# EasyEDA Pro project ALLModule_v1_0_2025-04-21.eprj, board MasterCtrlPCB
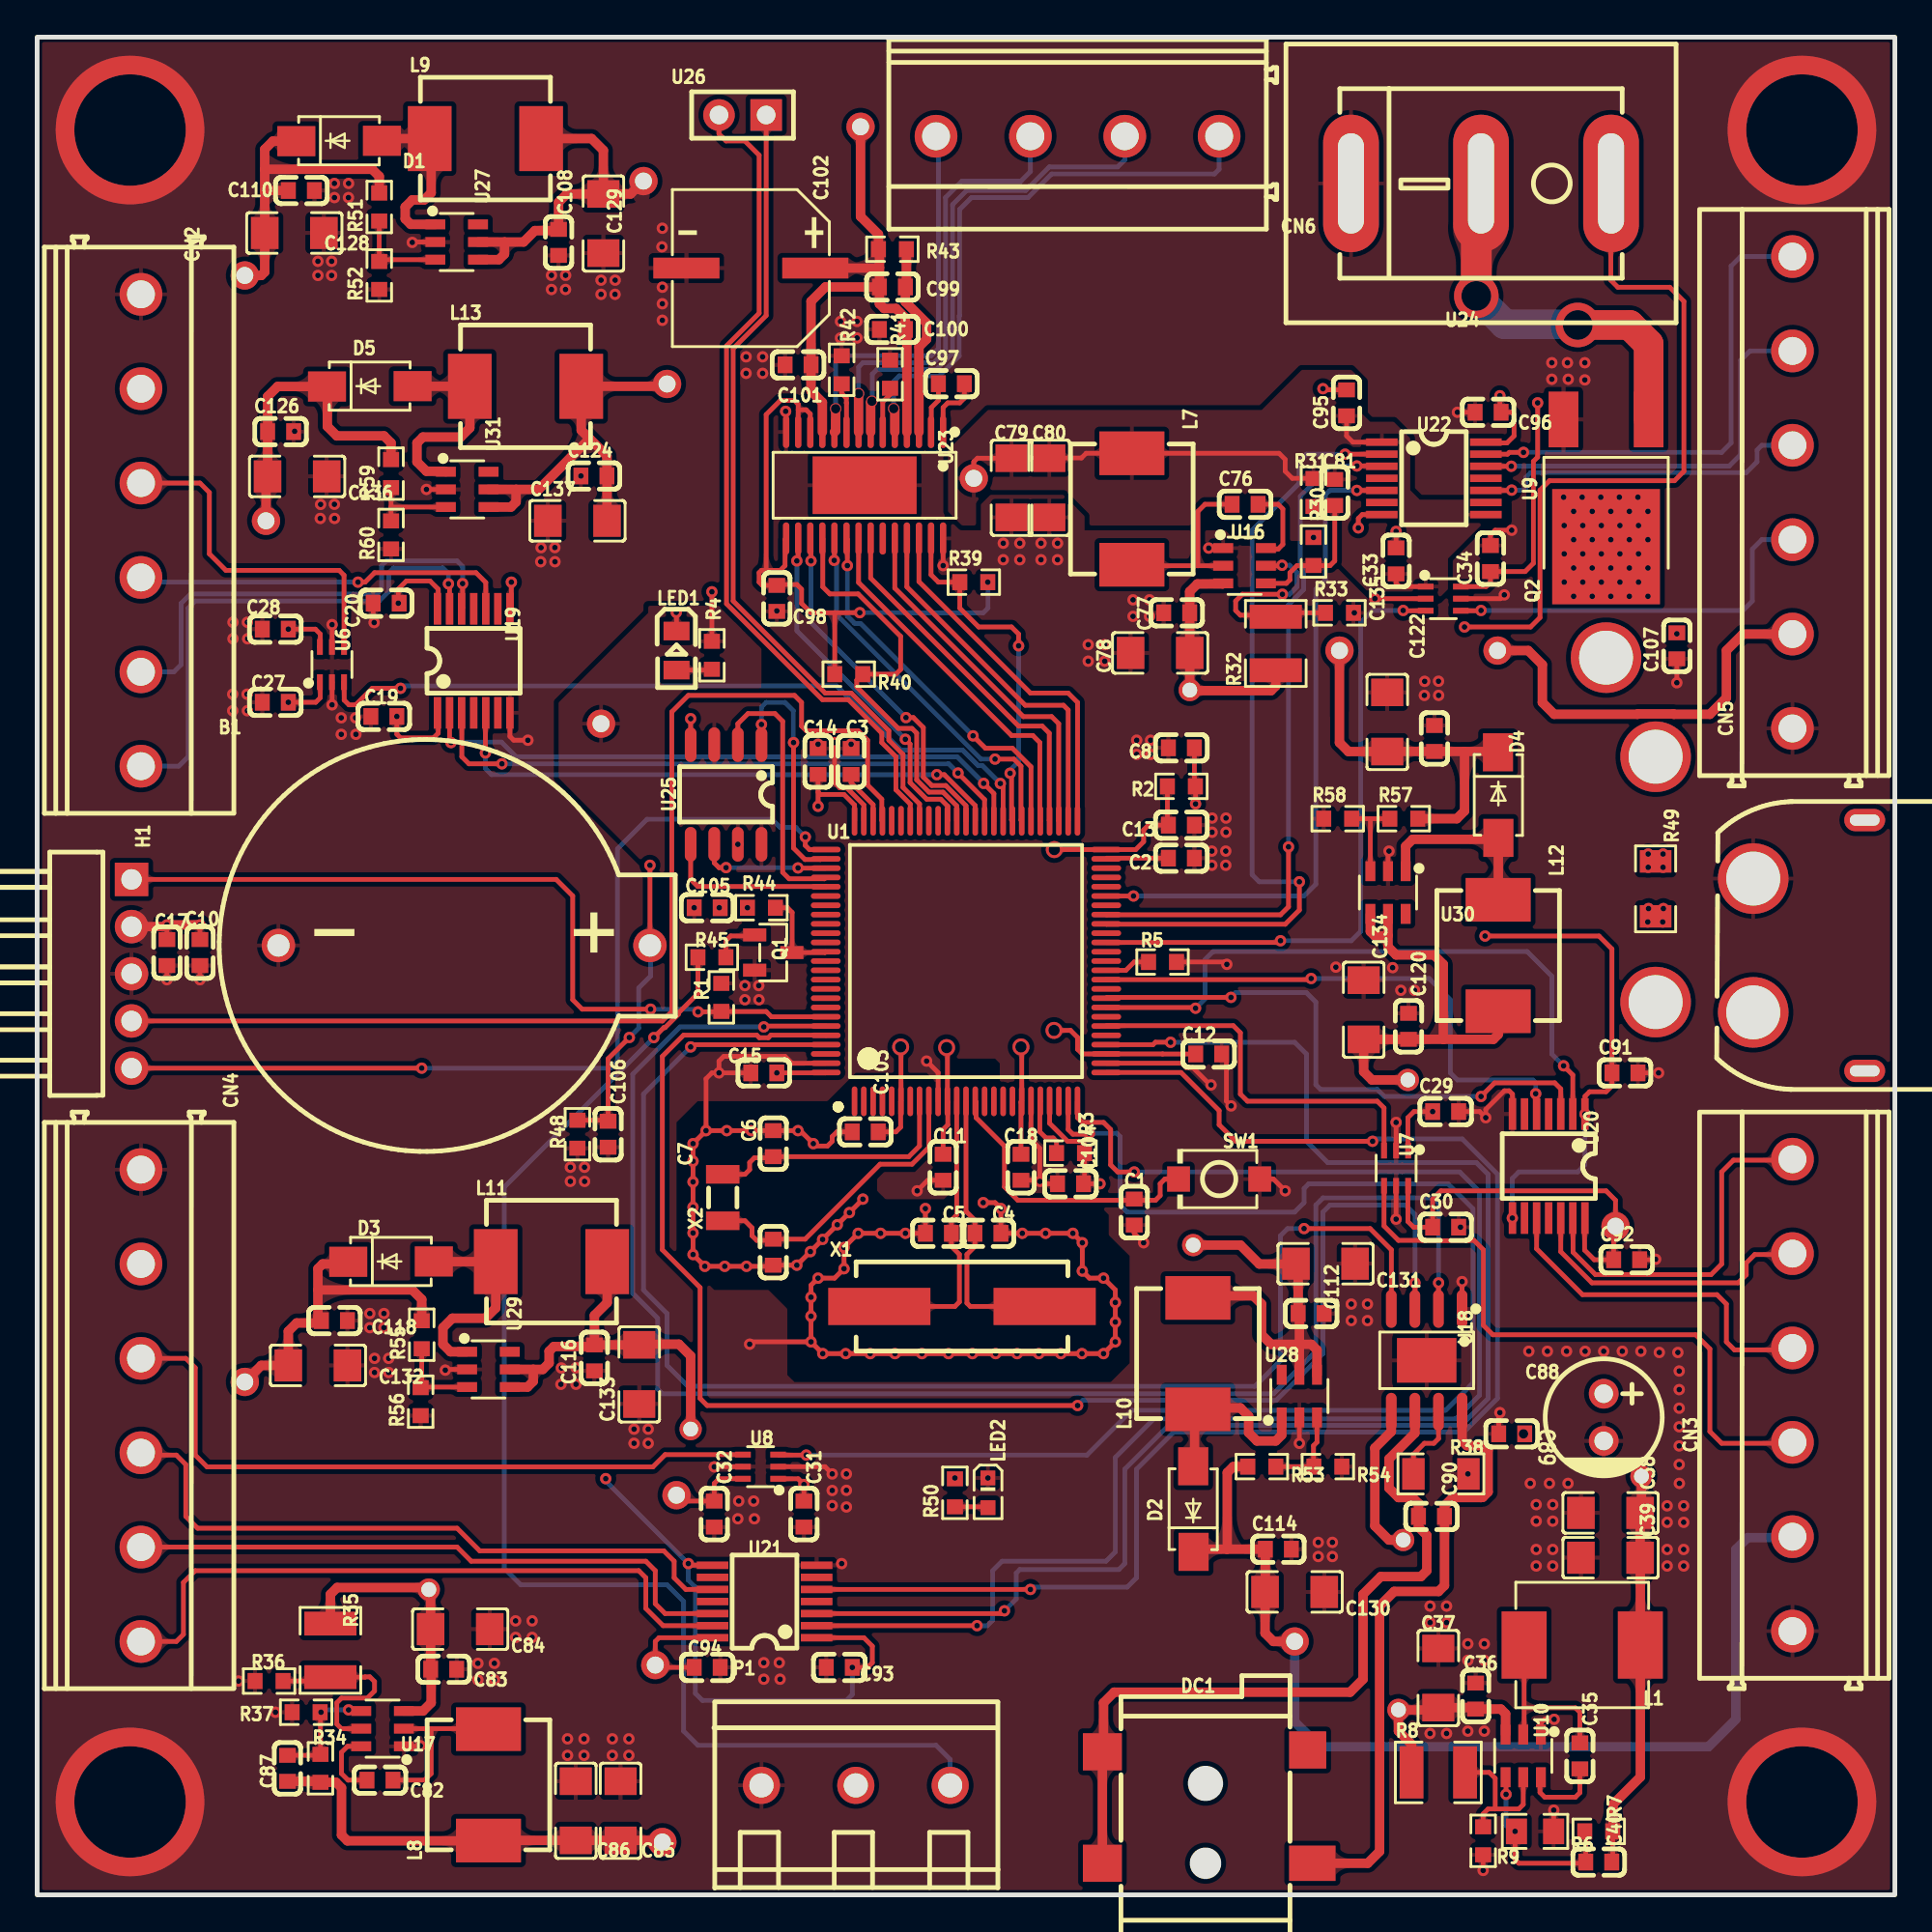
[diagram p4: board, top side]
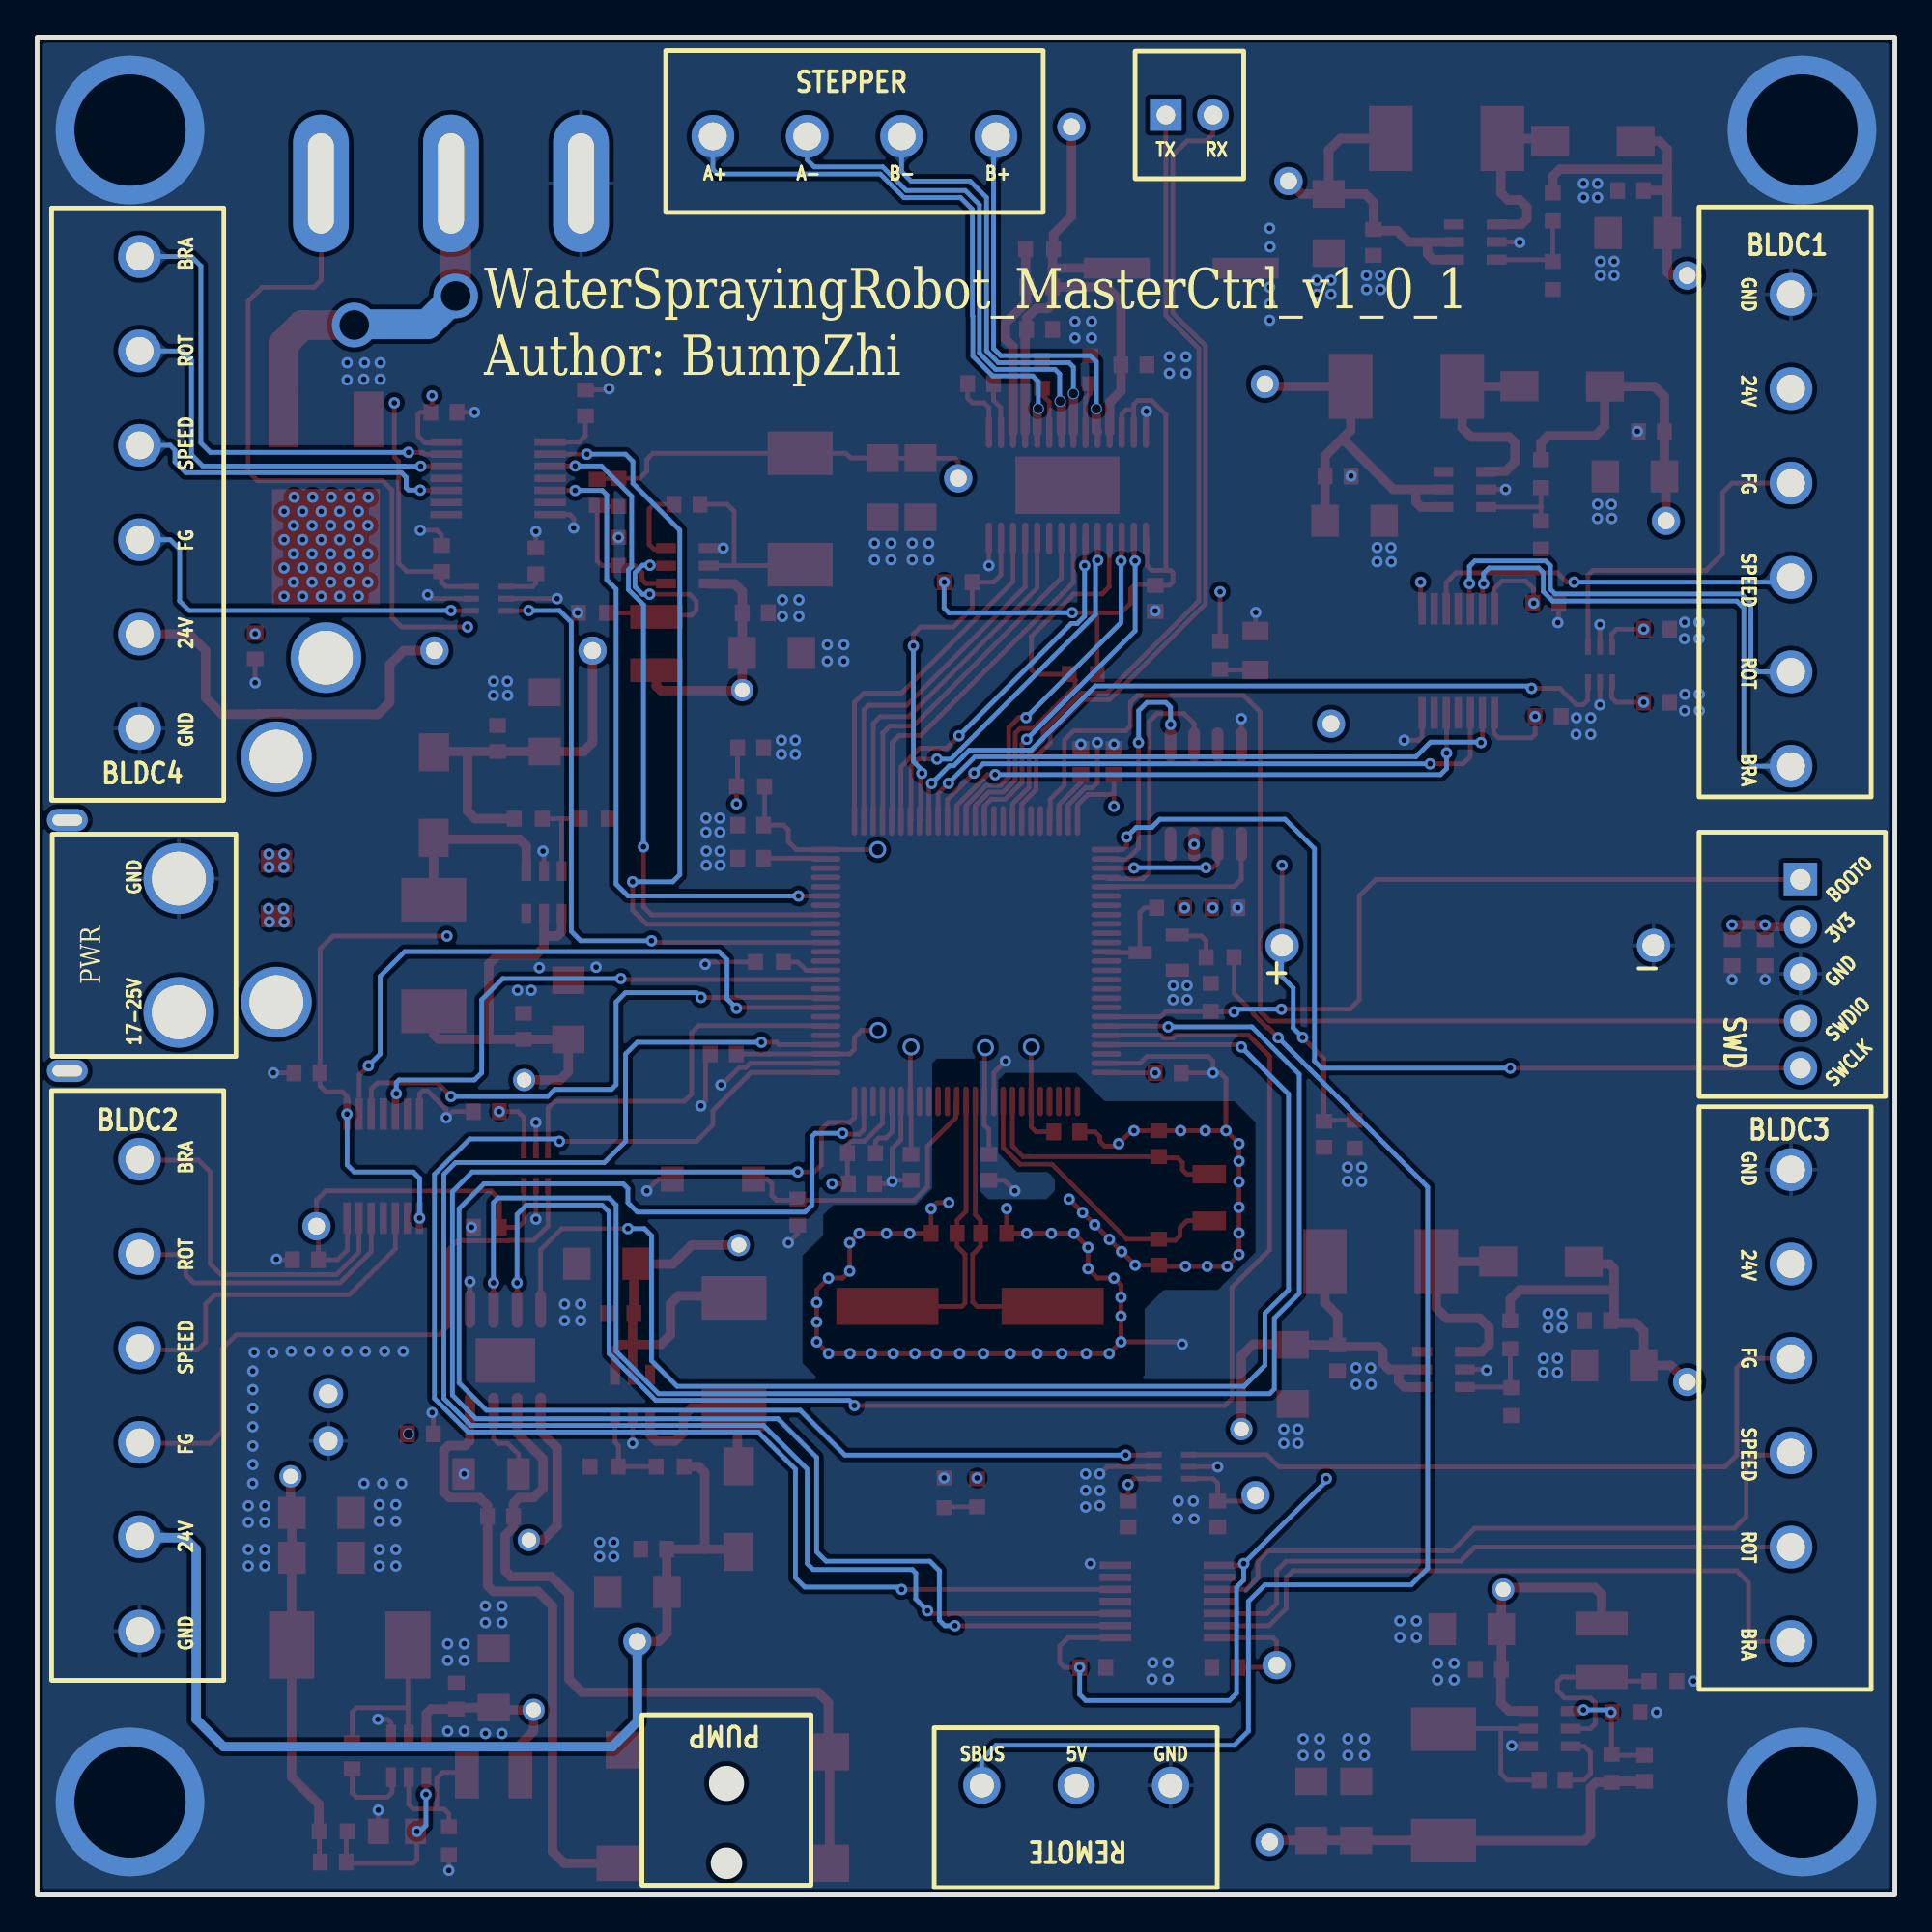
[diagram p5: board, bottom side, seen from below]

Outline 100 x 100 mm; copper layers: Top Layer, GND, PWR, Bottom Layer. Coordinates in mm from the lower left corner of the outline.
Outline path: rectangle 0,100 100,0
Stack: Top Layer 0.035mm 外层铜厚1oz / Dielectric1 0.2104mm 7628 RC49% 8.6mil / GND 0.0152mm 内层铜厚 / Dielectric2 1.065mm 1.1mm H/HOZ Copper / PWR 0.0152mm 内层铜厚 / Dielectric3 0.2104mm 7628 RC49% 8.6mil / Bottom Layer 0.035mm 外层铜厚1oz

## Design rules (mm)
net $1N1870: DP1
net $1N1876: DP1
net $1N2151: DP2
net $1N2157: DP2
template: JLCPCB Capability(Two Layers Board)
spacing copperThickness1oz (default): track to track 0.102, other pairs 0.152 to 0.3
spacing copperThickness2oz: track to track 0.203, other pairs 0.152 to 0.3
track width copperThickness1oz (default): min 0.127, default 0.254, max 2.54
track width copperThickness2oz: min 0.203, default 0.254, max 2.54
differential pair differentialPair (default): width min 0.127, default 0.254, max 2.54; gap min 0.152, default 0.152
via viaSize (default): diameter min 0.5, default 0.61, max 10; hole min 0.3, default 0.305, max 6.3

## Placement (name value [footprint] x y rotation side)
B1  BS-02-A1AJ010  [BAT-TH_BS-02-A1AJ010]  22.99 51.11 0 top
C1  100nF  [C0603]  59.06 36.75 90 top
C2  2.2uF  [C0603]  61.59 55.8 180 top
C3  2.2uF  [C0603]  43.81 61.01 270 top
C4  20pF  [C0603]  51.18 35.61 180 top
C5  20pF  [C0603]  48.51 35.61 0 top
C6  20pF  [C0603]  39.62 40.44 270 top
C7  20pF  [C0603]  39.62 34.59 90 top
C8  100nF  [C0603]  61.59 61.74 180 top
C10  100nF  [C0603]  8.76 50.72 90 top
C11  100nF  [C0603]  48.77 39.17 90 top
C12  100nF  [C0603]  63.06 45.26 180 top
C13  100nF  [C0603]  61.59 57.58 180 top
C14  100nF  [C0603]  42.04 61.01 270 top
C15  100nF  [C0603]  39.12 44.25 0 top
C17  10uF  [C0603]  6.98 50.72 90 top
C18  100nF  [C0603]  52.96 39.17 90 top
C19  100nF  [C0603]  18.66 63.43 180 top
C20  100nF  [C0603]  18.79 69.53 180 top
C27  100nF  [C0603]  12.82 64.2 180 top
C28  100nF  [C0603]  12.82 68.13 180 top
C29  100nF  [C0603]  75.82 42.16 0 top
C30  100nF  [C0603]  75.82 35.94 0 top
C31  100nF  [C0603]  41.28 20.5 270 top
C32  100nF  [C0603]  36.45 20.5 270 top
C33  100nF  [C0603]  73.15 71.81 90 top
C34  100nF  [C0603]  78.23 71.93 90 top
C35  100nF  [C0603]  83.04 7.48 270 top
C36  100nF  [C0603]  77.43 10.7 270 top
C37  22uF  [C1206]  75.42 11.67 270 top
C38  22uF  [C1206]  84.7 20.56 0 top
C39  22uF  [C1206]  84.7 18.15 0 top
C40  100pF  [C0603]  84.06 1.76 0 top
C76  100nF  [C0603]  65.02 74.85 0 top
C77  100nF  [C0603]  61.34 69.01 0 top
C78  22uF  [C1206]  60.45 66.85 0 top
C79  22uF  [C1206]  52.45 75.74 90 top
C80  22uF  [C1206]  54.48 75.74 90 top
C81  47pF  [C0603]  69.85 75.49 90 top
C82  100nF  [C0603]  18.45 6.18 180 top
C83  100nF  [C0603]  21.88 12.14 180 top
C84  22uF  [C1206]  22.77 14.3 180 top
C85  22uF  [C1206]  31.41 4.52 270 top
C86  22uF  [C1206]  28.99 4.52 270 top
C87  100pF  [C0603]  13.47 6.81 270 top
C88  47uF  [CAP-TH_BD6.3-P2.50-D1.0-FD]  84.33 25.71 270 top
C89  100nF  [C0603]  79.38 24.82 0 top
C90  100nF  [C0603]  75.06 20.37 0 top
C91  100nF  [C0603]  85.47 44.25 0 top
C92  100nF  [C0603]  85.56 34.19 0 top
C93  100nF  [C0603]  43.18 12.24 180 top
C94  100nF  [C0603]  36.07 12.24 0 top
C95  100nF  [C0603]  70.49 80.31 90 top
C96  100nF  [C0603]  78.1 79.81 180 top
C97  10nF  [C0603]  49.21 81.35 0 top
C98  470nF  [C0603]  39.82 69.79 90 top
C99  100nF  [C0603]  46.04 86.55 0 top
C100  100nF  [C0603]  46.04 84.27 0 top
C101  100nF  [C0603]  40.96 82.36 0 top
C102  100uF  [CAP-SMD_BD8.1-L8.3-W8.3-LS9.3-FD]  38.42 87.57 180 top
C103  100nF  [C0603]  44.58 41.07 0 top
C104  10nF  [C0603]  55.63 38.28 0 top
C105  100nF  [C0603]  36.07 53.14 0 top
C106  100nF  [C0603]  30.73 40.94 270 top
C107  100nF  [C0603]  88.26 67.23 90 top
C108  100nF  [C0603]  28.07 88.95 90 top
C110  100nF  [C0603]  14.22 91.75 0 top
C112  100nF  [C0603]  68.58 31.29 180 top
C114  100nF  [C0603]  66.81 18.61 0 top
C116  100nF  [C0603]  30 28.9 90 top
C118  100nF  [C0603]  16 30.91 0 top
C120  100nF  [C0603]  73.82 46.75 270 top
C122  100nF  [C0603]  75.22 62.25 90 top
C124  100nF  [C0603]  29.97 76.38 0 top
C126  100nF  [C0603]  13.11 78.77 0 top
C128  10uF  [C1206]  13.84 89.46 180 top
C129  10uF  [C1206]  30.48 89.97 90 top
C130  10uF  [C1206]  67.69 16.31 180 top
C131  10uF  [C1206]  69.35 33.97 180 top
C132  10uF  [C1206]  15.11 28.5 180 top
C133  10uF  [C1206]  32.41 28.02 90 top
C134  10uF  [C1206]  71.41 47.64 270 top
C135  10uF  [C1206]  72.68 63.14 270 top
C136  10uF  [C1206]  13.99 76.35 180 top
C137  10uF  [C1206]  29.08 73.97 0 top
CN1  XT60PW-M  [CONN-TH_XT60PW-M]  95.38 51.11 180 top
CN2  DB128V-5.08-6P-GN-S  [CONN-TH_6P-P5.08_DIBO_DB128V-5.08]  5.59 73.46 270 top
CN3  DB128V-5.08-6P-GN-S  [CONN-TH_6P-P5.08_DIBO_DB128V-5.08]  94.49 26.9 90 top
CN4  DB128V-5.08-6P-GN-S  [CONN-TH_6P-P5.08_DIBO_DB128V-5.08]  5.59 26.34 270 top
CN5  DB128V-5.08-6P-GN-S  [CONN-TH_6P-P5.08_DIBO_DB128V-5.08]  94.49 75.49 90 top
CN6  DB128V-5.08-4P-GN-S  [CONN-TH_4P-P5.08_DIBO_DB128V-5.08]  56.01 94.67 180 top
D1  SS54  [SMA_L4.3-W2.6-LS5.0-FD]  16.26 94.41 180 top
D2  SS54  [SMA_L4.3-W2.6-LS5.0-FD]  62.24 20.77 270 top
D3  SS54  [SMA_L4.3-W2.6-LS5.0-FD]  19.05 34.09 180 top
D4  SS54  [SMA_L4.3-W2.6-LS5.0-FD]  78.65 59.2 90 top
D5  SS54  [SMA_L4.3-W2.6-LS5.0-FD]  17.91 81.2 180 top
DC1  DC050-T  [DC-IN_DC050-T]  62.99 4.75 90 top
H1  PZ254R-11-05P  [HDR-TH_5P-P2.54-H-M-W10.4]  5.08 49.58 270 top
L1  22uH  [IND-SMD_L7.0-W6.6_FXL0630]  83.17 13.45 0 top
L7  10uH  [IND-SMD_L7.3-W6.8]  58.93 74.6 270 top
L8  22uH  [IND-SMD_L7.3-W6.8]  24.3 5.92 90 top
L9  10uH  [IND-SMD_L7.3-W6.8]  24.13 94.54 0 top
L10  10uH  [IND-SMD_L7.3-W6.8]  62.48 29.13 90 top
L11  10uH  [IND-SMD_L7.3-W6.8]  27.69 34.09 0 top
L12  10uH  [IND-SMD_L7.3-W6.8]  78.65 50.56 270 top
L13  10uH  [IND-SMD_L7.3-W6.8]  26.29 81.2 0 top
LED1  SZYY0805R  [LED0805-R-RD]  34.42 66.98 270 top
LED2  XL-1608UGC-04  [LED0603-RD_GREEN]  51.18 21.64 270 top
NOREF  -  [Pad_e256]  87.12 48.06 0 top
NOREF#2  -  [Pad_e219]  33.66 2.84 0 top
NOREF#3  -  [Pad_e1142]  44.32 95.17 0 top
NOREF#4  -  [Pad_e968]  12.32 73.97 0 top
NOREF#5  -  [Pad_e485]  86.36 22.53 0 top
NOREF#6  -  [Pad_e3178]  78.61 66.98 0 top
NOREF#7  -  [Pad_e263]  87.12 61.27 0 top
NOREF#8  -  [Pad_e777]  73.79 43.87 0 top
NOREF#9  -  [Pad_e889]  62.04 64.85 0 top
NOREF#10  -  [Pad_e920]  33.91 81.33 0 top
NOREF#11  -  [Pad_e261]  33.27 12.37 0 top
NOREF#12  -  [Pad_e409]  32.64 92.25 0 top
NOREF#13  -  [Pad_e884]  62.23 34.98 0 top
NOREF#14  -  [Pad_e264]  84.46 66.6 0 top
NOREF#15  -  [Pad_e1285]  35.18 25.07 0 top
NOREF#16  -  [Pad_e561]  73.53 19.1 0 top
NOREF#17  -  [Pad_e2020]  50.42 76.25 0 top
NOREF#18  -  [Pad_e888]  21.08 16.43 0 top
NOREF#19  -  [Pad_e5354]  30.35 63.04 0 top
NOREF#20  -  [Pad_e2890]  67.69 13.64 0 top
NOREF#21  -  [Pad_e3174]  70.1 66.98 0 top
NOREF#22  -  [Pad_e890]  73.28 9.96 0 top
NOREF#23  -  [Pad_e2753]  84.96 35.99 0 top
NOREF#24  -  [Pad_e2583]  11.18 87.17 0 top
NOREF#25  -  [Pad_e2164]  11.18 27.61 0 top
NOREF#26  -  [Pad_e1329]  34.42 21.51 0 top
P1  WJ500V-5.08-3P  [CONN-TH_3P-P5.00_WJ500V-5.08-3P]  44.07 5.89 0 top
Q1  SS8050  [SOT-23-3_L2.9-W1.3-P1.90-LS2.4-BR]  39.62 50.72 180 top
Q2  MDD50N03D  [TO-252-2_L6.6-W6.1-P4.57-LS9.9-BR-CW]  84.46 76 90 top
R1  10K  [R0603]  36.83 48.31 270 top
R2  0  [R0603]  61.59 59.67 0 top
R3  0  [R0603]  55.63 39.93 0 top
R4  510  [R0603]  36.32 66.73 90 top
R5  10K  [R0603]  60.58 50.22 180 top
R6  5.23kΩ  [R0805]  80.63 3.42 180 top
R7  100K  [R0603]  84.06 3.42 0 top
R8  365kΩ  [R1210]  75.42 6.59 0 top
R9  27kΩ  [R0603]  77.84 2.91 270 top
R30  22kΩ  [R0603]  68.71 72.31 270 top
R31  100K  [R0603]  68.71 75.49 90 top
R32  365kΩ  [R1210]  66.68 67.36 90 top
R33  27kΩ  [R0603]  70.1 69.01 0 top
R34  100K  [R0603]  15.25 6.81 270 top
R35  365kΩ  [R1210]  15.79 13.16 270 top
R36  27kΩ  [R0603]  12.48 11.51 180 top
R37  13.3K  [R0603]  14.48 9.83 0 top
R38  110mΩ  [R1206]  75.56 22.66 0 top
R39  10kΩ  [R0603]  50.42 70.66 0 top
R40  10kΩ  [R0603]  43.69 65.71 180 top
R41  500mΩ  [R0603]  45.91 81.85 270 top
R42  500mΩ  [R0603]  43.31 82.09 270 top
R43  1MΩ  [R0603]  46.04 88.58 0 top
R44  10K  [R0603]  38.99 53.14 180 top
R45  1K  [R0603]  36.32 50.47 180 top
R48  10K  [R0603]  29.08 40.94 270 top
R49  10kΩ  [R1206]  87.12 54.15 270 top
R50  2.2K  [R0603]  49.4 21.64 90 top
R51  390kΩ  [R0603]  18.42 90.86 90 top
R52  10K  [R0603]  18.42 87.17 90 top
R53  390kΩ  [R0603]  65.92 23.05 180 top
R54  10K  [R0603]  69.48 23.05 180 top
R55  390kΩ  [R0603]  20.7 30.15 90 top
R56  10K  [R0603]  20.64 26.55 90 top
R57  390kΩ  [R0603]  73.57 57.93 0 top
R58  10K  [R0603]  70.01 57.93 0 top
R59  390kΩ  [R0603]  19.05 76.5 90 top
R60  10K  [R0603]  19.05 73.2 90 top
SW1  TS-1088-AR02016  [SW-SMD_L3.9-W3.0-P4.45]  63.63 38.53 180 top
U1  STM32F407VET6TR  [LQFP-100_L14.0-W14.0-P0.50-LS16.0-BL]  50 50.27 0 top
U6  SN74LVC1T45DCKR  [SC-70-6_L2.2-W1.3-P0.65-LS2.2-BR]  15.87 66.23 270 top
U7  SN74LVC1T45DCKR  [SC-70-6_L2.2-W1.3-P0.65-LS2.2-BR]  73.15 39.12 90 top
U8  SN74LVC1T45DCKR  [SC-70-6_L2.2-W1.3-P0.65-LS2.2-BR]  38.94 23.05 0 top
U9  SN74LVC1T45DCKR  [SC-70-6_L2.2-W1.3-P0.65-LS2.2-BR]  75.69 69.77 180 top
U10  TPS54302DDCR  [SOT-23-6_L2.9-W1.6-P0.95-LS2.8-BL]  80 7.48 180 top
U16  TPS54302DDCR  [SOT-23-6_L2.9-W1.6-P0.95-LS2.8-BL]  64.99 71.55 270 top
U17  TPS54302DDCR  [SOT-23-6_L2.9-W1.6-P0.95-LS2.8-BL]  18.59 8.95 90 top
U18  DRV8870DDAR  [HSOP-8_L5.0-W4.0-P1.27-LS6.2-BL-EP]  74.8 28.77 180 top
U19  RS0104YQ  [TSSOP-14_L5.0-W4.4-P0.65-LS6.4-BL]  23.5 66.43 0 top
U20  RS0104YQ  [TSSOP-14_L5.0-W4.4-P0.65-LS6.4-BL]  81.37 39.23 180 top
U21  RS0104YQ  [TSSOP-14_L5.0-W4.4-P0.65-LS6.4-BL]  39.16 15.79 90 top
U22  RS0104YQ  [TSSOP-14_L5.0-W4.4-P0.65-LS6.4-BL]  75.18 76.25 270 top
U23  DRV8825PWPR  [HTSSOP-28_L9.7-W4.4-P0.65-LS6.4-BL-EP]  44.54 75.88 180 top
U24  RS601-1020011BB  [SW-TH_RS601-1020011BB]  77.72 92.13 180 top
U25  W25Q16JVSNIQ  [SOP-8_L4.9-W3.9-P1.27-LS6.0-BL]  37.08 59.23 180 top
U26  ZX-PM2.54-1-2PY  [HDR-TH_2P-P2.54-V-F]  37.97 95.81 180 top
U27  MT3608  [SOT-23-6_L2.9-W1.6-P0.95-LS2.8-BL]  22.58 88.97 270 top
U28  MT3608  [SOT-23-6_L2.9-W1.6-P0.95-LS2.8-BL]  67.94 26.85 0 top
U29  MT3608  [SOT-23-6_L2.9-W1.6-P0.95-LS2.8-BL]  24.3 28.28 270 top
U30  MT3608  [SOT-23-6_L2.9-W1.6-P0.95-LS2.8-BL]  72.72 53.95 180 top
U31  MT3608  [SOT-23-6_L2.9-W1.6-P0.95-LS2.8-BL]  23.15 75.66 270 top
X1  8MHz  [CRYSTAL-SMD_L11.5-W4.8-LS12.7]  49.78 31.67 0 top
X2  32.768kHz  [FC-135R_L3.2-W1.5]  36.91 37.54 90 top

## Footprints (pads in the part's own frame, mm; a bottom-side part is the same pattern mirrored in y, then rotated)
BAT-TH_BS-02-A1AJ010
  round 1.8 hole 1.2: 1(-10,0) 2(10,0)
C0603
  rect 0.8x0.9 smd: 1(-0.7,0) 2(0.7,0)
C1206
  rect 1.485x1.728 smd: 1(-1.593,0) 2(1.593,0)
CAP-SMD_BD8.1-L8.3-W8.3-LS9.3-FD
  rect 3.56x1.12 smd: 1(-3.47,0) 2(3.47,0)
CAP-TH_BD6.3-P2.50-D1.0-FD
  round 1.6 hole 1: 1(-1.27,0) 2(1.27,0)
CONN-TH_3P-P5.00_WJ500V-5.08-3P
  round 2 hole 1.3: 1(-5.08,0) 2(0,0) 3(5.08,0)
CONN-TH_4P-P5.08_DIBO_DB128V-5.08
  round 2.3 hole 1.5: 1(-7.62,0) 2(-2.54,0) 3(2.54,0) 4(7.62,0)
CONN-TH_6P-P5.08_DIBO_DB128V-5.08
  round 2.3 hole 1.5: 1(-12.7,0) 2(-7.62,0) 3(-2.54,0) 4(2.54,0) 5(7.62,0) 6(12.7,0)
CONN-TH_XT60PW-M
  round 3.8 hole 2.9: 1(3,-3.6) 2(3,3.6)
  oval 2.2x1.2 hole 1.6x0.6: 3(-3,6.75) 4(-3,-6.75)
CRYSTAL-SMD_L11.5-W4.8-LS12.7
  rect 5.5x2 smd: 1(-4.45,0) 2(4.45,0)
DC-IN_DC050-T
  rect 2x2.1 smd: 1(-3.05,5.65) 1(2.95,5.65)
  rect 1.9x2.5 smd: 2(-3.05,-5.65)
  rect 2x2 smd: 3(3.05,-5.4)
FC-135R_L3.2-W1.5
  rect 1x1.8 smd: 1(-1.25,0) 2(1.25,0)
HDR-TH_2P-P2.54-V-F
  rect 1.7x1.7 hole 1: 1(-1.27,0)
  round 1.7 hole 1: 2(1.27,0)
HDR-TH_5P-P2.54-H-M-W10.4
  rect 1.8x1.8 hole 1.1: 1(-5.08,0)
  round 1.8 hole 1.1: 2(-2.54,0) 3(0,0) 4(2.54,0) 5(5.08,0)
HSOP-8_L5.0-W4.0-P1.27-LS6.2-BL-EP
  oval 0.574x2.038 smd: 1(-1.905,-2.769) 2(-0.635,-2.769) 3(0.635,-2.769) 4(1.905,-2.769) 5(1.905,2.769) 6(0.635,2.769) 7(-0.635,2.769) 8(-1.905,2.769)
  rect 3.2x2.4 smd: 9(0,0)
HTSSOP-28_L9.7-W4.4-P0.65-LS6.4-BL-EP
  oval 0.343x1.732 smd: 1(-4.225,-2.866) 2(-3.575,-2.866) 3(-2.925,-2.866) 4(-2.275,-2.866) 5(-1.625,-2.866) 6(-0.975,-2.866) 7(-0.325,-2.866) 8(0.325,-2.866) 9(0.975,-2.866) 10(1.625,-2.866) 11(2.275,-2.866) 12(2.925,-2.866) 13(3.575,-2.866) 14(4.225,-2.866) 15(4.225,2.866) 16(3.575,2.866) 17(2.925,2.866) 18(2.275,2.866) 19(1.625,2.866) 20(0.975,2.866) 21(0.325,2.866) 22(-0.325,2.866) 23(-0.975,2.866) 24(-1.625,2.866) 25(-2.275,2.866) 26(-2.925,2.866) 27(-3.575,2.866) 28(-4.225,2.866)
  rect 5.6x3.1 smd: 29(0,0)
IND-SMD_L7.0-W6.6_FXL0630
  rect 2.424x3.62 smd: 1(3.128,0) 2(-3.128,0)
IND-SMD_L7.3-W6.8
  rect 2.35x3.5 smd: 1(-3,0) 2(3,0)
LED0603-RD_GREEN
  rect 0.8x0.8 smd: 1(-0.799,-0.004) 2(0.799,0.004)
LED0805-R-RD
  rect 1x1.399 smd: 1(1.05,0) 2(-1.05,0)
LQFP-100_L14.0-W14.0-P0.50-LS16.0-BL
  oval 0.3x1.6 smd: 1(-6,-7.55) 2(-5.5,-7.55) 3(-5,-7.55) 4(-4.5,-7.55) 5(-4,-7.55) 6(-3.5,-7.55) 7(-3,-7.55) 8(-2.5,-7.55) 9(-2,-7.55) 10(-1.5,-7.55) 11(-1,-7.55) 12(-0.5,-7.55) 13(0,-7.55) 14(0.5,-7.55) 15(1,-7.55) 16(1.5,-7.55) 17(2,-7.55) 18(2.5,-7.55) 19(3,-7.55) 20(3.5,-7.55) 21(4,-7.55) 22(4.5,-7.55) 23(5,-7.55) 24(5.5,-7.55) 25(6,-7.55) 51(6,7.55) 52(5.5,7.55) 53(5,7.55) 54(4.5,7.55) 55(4,7.55) 56(3.5,7.55) 57(3,7.55) 58(2.5,7.55) 59(2,7.55) 60(1.5,7.55) 61(1,7.55) 62(0.5,7.55) 63(0,7.55) 64(-0.5,7.55) 65(-1,7.55) 66(-1.5,7.55) 67(-2,7.55) 68(-2.5,7.55) 69(-3,7.55) 70(-3.5,7.55) 71(-4,7.55) 72(-4.5,7.55) 73(-5,7.55) 74(-5.5,7.55) 75(-6,7.55)
  oval 1.6x0.3 smd: 26(7.55,-6) 27(7.55,-5.5) 28(7.55,-5) 29(7.55,-4.5) 30(7.55,-4) 31(7.55,-3.5) 32(7.55,-3) 33(7.55,-2.5) 34(7.55,-2) 35(7.55,-1.5) 36(7.55,-1) 37(7.55,-0.5) 38(7.55,0) 39(7.55,0.5) 40(7.55,1) 41(7.55,1.5) 42(7.55,2) 43(7.55,2.5) 44(7.55,3) 45(7.55,3.5) 46(7.55,4) 47(7.55,4.5) 48(7.55,5) 49(7.55,5.5) 50(7.55,6) 76(-7.55,6) 77(-7.55,5.5) 78(-7.55,5) 79(-7.55,4.5) 80(-7.55,4) 81(-7.55,3.5) 82(-7.55,3) 83(-7.55,2.5) 84(-7.55,2) 85(-7.55,1.5) 86(-7.55,1) 87(-7.55,0.5) 88(-7.55,0) 89(-7.55,-0.5) 90(-7.55,-1) 91(-7.55,-1.5) 92(-7.55,-2) 93(-7.55,-2.5) 94(-7.55,-3) 95(-7.55,-3.5) 96(-7.55,-4) 97(-7.55,-4.5) 98(-7.55,-5) 99(-7.55,-5.5) 100(-7.55,-6)
Pad_e219
  round 1.524 hole 0.914: 1(0,0)
Pad_e256
  round 3.8 hole 2.9: 1(0,0)
Pad_e261
  round 1.524 hole 0.914: 1(0,0)
Pad_e263
  round 3.8 hole 2.9: 1(0,0)
Pad_e264
  round 3.8 hole 2.9: 1(0,0)
Pad_e409
  round 1.524 hole 0.914: 1(0,0)
Pad_e485
  round 1.2 hole 0.8: 1(0,0)
Pad_e561
  round 1.2 hole 0.8: 1(0,0)
Pad_e777
  round 1.2 hole 0.8: 1(0,0)
Pad_e884
  round 1.2 hole 0.8: 1(0,0)
Pad_e888
  round 1.2 hole 0.8: 1(0,0)
Pad_e889
  round 1.2 hole 0.8: 1(0,0)
Pad_e890
  round 1.2 hole 0.8: 1(0,0)
Pad_e920
  round 1.524 hole 0.914: 1(0,0)
Pad_e968
  round 1.524 hole 0.914: 1(0,0)
Pad_e1142
  round 1.524 hole 0.914: 1(0,0)
Pad_e1285
  round 1.2 hole 0.8: 1(0,0)
Pad_e1329
  round 1.524 hole 0.914: 1(0,0)
Pad_e2020
  round 1.524 hole 0.914: 1(0,0)
Pad_e2164
  round 1.524 hole 0.914: 1(0,0)
Pad_e2583
  round 1.524 hole 0.914: 1(0,0)
Pad_e2753
  round 1.524 hole 0.914: 1(0,0)
Pad_e2890
  round 1.524 hole 0.914: 1(0,0)
Pad_e3174
  round 1.524 hole 0.914: 1(0,0)
Pad_e3178
  round 1.524 hole 0.914: 1(0,0)
Pad_e5354
  round 1.524 hole 0.914: 1(0,0)
R0603
  rect 0.806x0.864 smd: 1(-0.753,0) 2(0.753,0)
R0805
  rect 1.133x1.377 smd: 1(-1,0) 2(1,0)
R1206
  rect 1.208x1.701 smd: 1(-1.479,0) 2(1.479,0)
R1210
  rect 1.282x2.808 smd: 1(-1.441,0) 2(1.441,0)
SC-70-6_L2.2-W1.3-P0.65-LS2.2-BR
  rect 0.841x0.315 smd: 1(0.946,-0.65) 2(0.946,0) 3(0.946,0.65) 4(-0.946,0.65) 5(-0.946,0) 6(-0.946,-0.65)
SMA_L4.3-W2.6-LS5.0-FD
  rect 2.046x1.62 smd: 1(-2.304,-0.009) 2(2.304,0.009)
SOP-8_L4.9-W3.9-P1.27-LS6.0-BL
  oval 0.63x1.865 smd: 1(-1.905,-2.683) 2(-0.635,-2.683) 3(0.635,-2.683) 4(1.905,-2.683) 5(1.905,2.683) 6(0.635,2.683) 7(-0.635,2.683) 8(-1.905,2.683)
SOT-23-3_L2.9-W1.3-P1.90-LS2.4-BR
  rect 1.25x0.7 smd: 1(1,-0.95) 2(1,0.95) 3(-1,0)
SOT-23-6_L2.9-W1.6-P0.95-LS2.8-BL
  rect 0.532x1.072 smd: 1(-0.95,-1.149) 2(0,-1.149) 3(0.95,-1.149) 4(0.95,1.149) 5(0,1.149) 6(-0.95,1.149)
SW-SMD_L3.9-W3.0-P4.45
  rect 1.23x1.36 smd: 1(-2.185,0) 2(2.185,0)
SW-TH_RS601-1020011BB
  oval 3x7.4 hole 1.4x5.4: 1(-7,0) 2(0,0) 3(7,0)
TO-252-2_L6.6-W6.1-P4.57-LS9.9-BR-CW
  rect 3x1.6 smd: 1(3.424,-2.29) 3(3.424,2.29)
  rect 6.2x5.8 smd: 2(-3.424,0)
TSSOP-14_L5.0-W4.4-P0.65-LS6.4-BL
  rect 0.4x1.7 smd: 1(-1.95,-2.8) 2(-1.3,-2.8) 3(-0.65,-2.8) 4(0,-2.8) 5(0.65,-2.8) 6(1.3,-2.8) 7(1.95,-2.8) 8(1.95,2.8) 9(1.3,2.8) 10(0.65,2.8) 11(0,2.8) 12(-0.65,2.8) 13(-1.3,2.8) 14(-1.95,2.8)

## Nets
As in the schematic, except:
3V3: C10.2 C11.2 C12.2 C13.2 C14.2 C15.2 C17.2 C18.2 C19.1 C27.1 C29.1 C31.1 C33.1 C79.2 C80.2 C81.2 C91.1 C93.1 C95.1 C103.2 C105.2 H1.2 L7.1 NOREF#17.1 NOREF#19.1 R2.1 R4.2 R31.2 R44.2 U1.6 U1.11 U1.19 U1.28 U1.50 U1.75 U1.100 U6.1 U7.1 U8.1 U9.1 U19.1 U19.8 U20.1 U20.8 U21.1 U21.8 U22.1 U22.8 U25.3 U25.7 U25.8
5V: C20.1 C28.1 C30.1 C32.1 C34.1 C85.2 C86.2 C87.2 C92.1 C94.1 C96.1 L8.1 NOREF#2.1 NOREF#11.1 NOREF#23.1 NOREF#26.1 P1.2 R34.2 U6.6 U7.6 U8.6 U9.6 U19.14 U20.14 U21.14 U22.14
BLDC1_24V: C110.1 C128.2 CN2.2 D1.2 NOREF#24.1 R51.2
BLDC2_24V: C114.1 C130.2 CN3.2 D2.2 NOREF#20.1 R53.2
BLDC3_24V: C118.1 C132.2 CN4.2 D3.2 NOREF#25.1 R55.2
BLDC4_24V: C122.1 C135.2 CN5.2 D4.2 NOREF#6.1 NOREF#21.1 R57.2
ORI_24V: C36.2 C37.2 C77.2 C78.2 C83.2 C84.2 C107.2 C108.2 C112.2 C116.2 C120.2 C124.2 C129.2 C131.2 C133.2 C134.2 C137.2 L9.2 L10.2 L11.2 L12.2 L13.2 NOREF#7.1 NOREF#8.1 NOREF#9.1 NOREF#10.1 NOREF#12.1 NOREF#13.1 NOREF#14.1 NOREF#15.1 NOREF#18.1 NOREF#22.1 Q2.2 R8.1 R32.1 R35.1 R49.1 R50.2 U10.3 U16.3 U17.3 U27.4 U27.5 U28.4 U28.5 U29.4 U29.5 U30.4 U30.5 U31.4 U31.5
ORI_24V_IN: CN1.2 NOREF.1 R49.2
PUMP_12V: C38.2 C39.2 C40.2 C88.1 C89.2 L1.1 NOREF#5.1 NOREF#16.1 R7.2 U18.5
STEPPER_24V: C99.1 C100.2 C101.2 C102.1 C126.1 C136.2 D5.2 NOREF#3.1 NOREF#4.1 R43.1 R59.2 U23.4 U23.11

Pads without a net: CN1 3 4; DC1 3; U1 1 2 3 4 5 7 15 16 17 18 23 30 32 35 38 39 41 44 46 47 48 66 67 70 71 81 82 83 84 85 86 88 89 90 91 92 93 98; U19 4 6 9 11; U20 4 6 9 11; U21 4 6 9 11; U22 4 6 9 11; U23 23; U27 6; U28 6; U29 6; U30 6; U31 6

## Via types
v1: diameter 0.61, hole 0.305, Top Layer to Bottom Layer, 463 vias
v2: diameter 8, hole 6, Top Layer to Bottom Layer, 4 vias
v3: diameter 0.914, hole 0.61, Top Layer to Bottom Layer, 5 vias
v4: diameter 0.61, hole 0.508, Top Layer to Bottom Layer, 5 vias
v5: diameter 2.4, hole 1.6, Top Layer to Bottom Layer, 2 vias

## Routing (per net, layer and track width the routed paths; a pad name or vN(x,y) marks a point on that pad's centre or on a via; arc(x,y) is an arc through that point)
3V: length 110.6
  Top Layer w0.254: U24.1 84.71,92.11 84.71,86.92 85.09,86.54 87.88,86.54 88.65,85.78 88.65,76.63 88.14,76.12 81.41,76.12 80.9,75.62 80.9,68.76 80.39,68.25 v1(76.84,68.25) ; v1(31.88,46.15) 30.73,45.01 C106.1 30.68,41.7 R48.1 ; B1.2 v1(32.99,55.42)
  PWR w0.254: v1(76.84,68.25) 60.13,68.25 60.12,68.24 58.37,68.24 58.36,68.25 34.04,68.25 32.99,67.2 v1(32.99,55.42)
  Bottom Layer w0.254: v1(31.88,46.15) 32.38,46.66 32.38,48.82 33.02,49.45 33.02,51.07 B1.2
3V3: length 434.5
  Top Layer w0.254: 42.04,59.36 42.16,59.23 43.43,59.23 44,58.67 U1.75 ; 42.04,59.36 C14.2 ; 42.04,59.36 v1(42.04,58.6) ; v3(54.75,56.27) U1.50 59.14,56.27 59.56,56.69 59.56,57.33 59.82,57.58 C13.2 60.84,57.64 R2.1 ; v1(19.36,63.43) 19.36,62.48 19.56,62.28 21.34,62.28 21.59,62.53 21.59,63.59 U19.1 ; C103.2 46.23,41.07 46.48,41.33 46.48,42.7 U1.6 46.5,45.63 v3(46.48,45.64) ; C10.2 v1(8.76,52.21) ; v1(13.52,64.2) 15,64.2 15.24,64.44 15.24,65.26 U6.1 ; C12.2 60.59,45.26 60.58,45.27 U1.28 56.26,45.27 56.01,45.52 56.01,46.15 55.63,46.53 v3(54.74,46.53) ; v1(43.88,12.24) 44.7,12.24 44.96,12.5 44.96,13.39 44.5,13.84 U21.1 ; v1(83.32,42.03) 83.32,42.99 83.57,43.23 84.46,43.23 84.77,43.55 C91.1 84.77,50.92 84.07,51.61 v1(77.94,51.61) ; U19.8 25.53,69.31 v1(25.53,70.66) ; C81.2 69.8,76.24 R31.2 68.7,76.25 67.56,76.25 67.18,76.63 67.18,77.27 66.85,77.6 L7.1 56.47,77.6 56.21,77.35 54.49,77.35 ; v3(52.96,45.64) 53,45.6 U1.19 52.96,42.68 C18.2 ; U7.1 73.79,40.08 73.79,41.83 74.12,42.16 v1(75.12,42.16) ; U1.100 42.43,44.25 v1(39.82,44.25) ; v1(35.05,17.83) 35.14,17.74 U21.8 ; C80.2 C79.2 50.61,77.34 50.42,77.14 NOREF#17.1 ; C95.1 70.49,78.54 70.82,78.2 72.38,78.2 ; C33.1 73.15,70.6 73.33,70.42 U9.1 ; C31.1 v1(41.28,22.09) 40.96,22.4 U8.1 ; v3(48.96,45.61) 49,45.56 U1.11 49.02,42.69 49.02,41.45 48.77,41.2 C11.2 ; C17.2 v1(6.98,52.21) ; R4.2 v1(36.32,70.14)
  Top Layer w0.508: v1(8.76,52.21) v1(6.98,52.21) 6.89,52.12 5.08,52.12
  PWR w0.254: 30.48,52.47 30.48,50.34 30.9,49.93 52.8,49.93 53.72,50.85 53.72,58.98 54.61,59.87 64.9,59.87 66.29,58.47 66.29,53.39 68.07,51.61 v1(77.94,51.61) ; 32.26,53.91 32.27,53.9 36.69,53.9 ; 30.61,24.18 31.37,24.18 32.89,22.66 36,22.66 36.21,22.45 40.91,22.45 v1(41.28,22.09) ; 30.61,24.18 30.61,41.58 26.8,45.39 26.8,52.47 ; 30.61,24.18 v1(30.61,22.4) ; 36.69,53.9 36.72,53.87 v1(36.72,53.14) ; 36.69,53.9 37.72,53.9 ; 37.72,53.9 37.72,53.9 v1(37.72,56.55) ; 37.72,53.9 38.22,53.9 ; v1(75.12,42.16) 75.12,41.26 74.85,41 72.91,41 72.76,41.15 65.02,41.15 64.52,40.64 64.52,38.91 63.25,37.64 55.12,37.64 54.67,38.09 54.67,43.8 54.1,44.37 54.1,45.64 ; 38.22,53.9 38.24,53.89 v1(38.24,53.14) ; 38.22,53.9 41.53,53.9 42.06,54.43 42.06,58.57 v1(42.04,58.6) ; v1(39.82,44.25) 39.69,44.12 39.69,43.8 39.37,43.48 29.72,43.48 28.07,45.14 28.07,52.38 28.05,52.39 28.05,52.47
  PWR w0.508: v1(8.76,52.21) 9.87,52.21 10.13,52.47 29.3,52.47 ; 29.3,52.47 29.27,52.44 29.27,45.45 30.23,44.5 35.18,44.5 36.32,45.64 v3(46.48,45.64) 46.52,45.61 v3(48.96,45.61) 48.99,45.64 v3(52.96,45.64) 54.36,45.64 54.74,46.03 v3(54.74,46.53) 54.75,46.55 v3(54.75,56.27) ; 29.3,52.47 31.72,52.47 32.26,53.01 32.26,68.25 34.16,70.16 50.04,70.16 50.42,70.54 NOREF#17.1
  Bottom Layer w0.254: v1(30.61,22.4) 30.61,22.28 v1(35.05,17.83) 35.05,16.94 35.43,16.56 35.43,10.85 35.81,10.47 43.56,10.47 43.88,10.78 v1(43.88,12.24) ; v1(83.32,42.03) 83.31,42.02 83.31,39.29 82.93,38.91 79.76,38.91 79.41,38.57 v1(79.41,36.43)
5V: length 432.8
  Top Layer w0.254: U20.14 83.3,36.41 83.3,34.71 83.82,34.19 C92.1 84.86,35.89 NOREF#23.1 84.96,37.39 84.46,37.9 75.56,37.9 75.12,37.45 C30.1 74.09,35.94 73.79,36.25 73.79,38.16 U7.6 ; v1(19.44,69.53) 19.44,70.29 19.88,70.73 21.15,70.73 21.59,70.28 21.59,69.27 U19.14 ; v1(78.74,80.7) 78.74,79.87 C96.1 79.38,79.81 79.5,79.68 79.5,78.54 79.12,78.16 78.03,78.16 77.98,78.2 ; v1(80.77,80.31) 80.77,77.39 80.54,77.17 80.54,71.68 80.1,71.23 C34.1 78.23,70.66 77.99,70.42 U9.6 ; U8.6 37.99,22.4 36.7,22.4 36.45,22.15 C32.1 34.73,21.2 NOREF#26.1 ; U21.14 33.47,13.84 33.27,13.64 NOREF#11.1 33.4,12.24 C94.1 ; U6.6 15.24,67.19 15.24,67.87 14.98,68.13 v1(13.52,68.13)
  Top Layer w0.508: C87.2 15.2,6.11 R34.2 16.09,6.06 16.38,5.77 16.38,3.23 16.7,2.91 24.28,2.91 L8.1 24.31,2.93 C86.2 C85.2 33.57,2.93 NOREF#2.1
  PWR w0.254: 12.43,66.6 12.45,66.62 12.45,67.87 12.7,68.12 13.51,68.12 v1(13.52,68.13) ; 88.52,31.67 88.52,31.68 88.52,39.42 90.55,41.45 95.63,41.45 96.39,42.22 96.39,57.96 95.63,58.72 91.57,58.72 90.81,59.49 90.81,80.19 90.04,80.95 78.99,80.95 v1(78.74,80.7) ; 87.71,31.67 87.71,40.26 89.41,41.96 95.38,41.96 95.88,42.47 95.88,57.58 95.38,58.09 91.06,58.09 90.3,58.85 90.3,79.68 89.66,80.31 v1(80.77,80.31)
  PWR w0.508: NOREF#26.1 22.1,21.51 19.12,18.54 ; v1(19.44,69.53) 19.44,66.99 19.05,66.6 10.54,66.6 9.78,65.84 9.78,56.95 9.14,56.31 3.81,56.31 3.17,55.68 3.17,41.96 4.19,40.94 12.95,40.94 14.03,39.87 14.03,23.63 19.12,18.54 ; 19.12,18.54 18.22,17.64 18.22,15.1 19.56,13.77 24.84,13.77 25.46,13.15 29.7,13.15 30.48,12.37 30.48,10.59 30.73,10.34 33.02,10.34 33.66,9.7 NOREF#2.1 ; NOREF#23.1 84.96,33.45 86.74,31.67 89.15,31.67 90.04,30.78 90.04,4.5 88.25,2.71 63.66,2.71 63.01,3.35 44.58,3.35 44.07,3.86 P1.2
GND: length 169.3
  Top Layer w0.254: U10.1 80.95,9.24 81.15,9.45 v1(81.66,9.45) ; C33.2 v1(73.15,73.39) ; U9.5 78.77,69.77 v1(78.98,69.98) ; v1(42.93,62.03) 42.93,59.87 43.21,59.59 43.58,59.59 44.5,58.67 U1.74 ; v1(50.93,37.26) 51.56,37.26 v1(51.88,36.94) C4.1 v1(53.03,35.61) v1(54.28,35.61) v1(55.75,35.61) v1(56.26,35.1) v1(56.26,33.58) 56.64,33.2 v1(57.4,33.2) 58.04,32.56 v1(58.04,31.89) v1(58.04,30.84) v1(58.04,29.77) v1(57.4,29.13) v1(56.24,29.13) v1(55.11,29.13) v1(53.92,29.13) v1(52.75,29.13) v1(51.6,29.13) v1(50.34,29.13) v1(49.06,29.13) v1(47.63,29.13) v1(46.18,29.13) v1(44.84,29.13) v1(43.53,29.13) v1(42.29,29.13) v1(41.66,29.77) ; v1(36.7,44.25) 36.32,44.25 36.01,43.93 v1(36.01,41.14) ; v1(36.7,44.25) C15.1 ; v1(36.7,44.25) 36.7,44.88 36.96,45.14 40.26,45.14 40.63,44.77 42.45,44.77 ; v1(67.18,37.9) 66.55,38.53 SW1.1 ; v1(79.38,73.46) 78.49,73.46 78.23,73.2 78.23,72.63 ; U23.14 40.32,79.83 v1(40.29,79.86) ; v1(34.4,69.03) 34.42,69.02 LED1.2 ; U8.5 36.46,23.05 v1(36.45,23.04) ; C20.2 18.09,68.54 v1(18.14,68.49) ; C11.1 47.94,38.47 v1(47.37,37.9) ; U22.7 71.33,74.3 71.12,74.09 v1(71.12,73.58) ; v1(47.88,44.88) 48.5,44.26 U1.10 ; U16.1 v1(63.07,72.5) ; C95.2 69.28,81.02 v1(69.22,81.08) ; R5.1 63.91,50.22 v1(64.04,50.09) ; C107.1 v1(88.26,65.25) ; v1(64.27,42.47) 64.02,42.72 64.02,45.01 C12.1 ; U18.1 v1(76.7,33.01) ; U9.2 v1(72.01,69.77) ; v1(26.42,62.15) 25.65,62.15 25.45,62.36 U19.7 ; 53.91,38.47 v1(53.97,38.41) 54.1,38.28 C104.1 ; 53.91,38.47 53.97,38.53 53.97,40.18 53.5,40.66 U1.20 ; 53.91,38.47 C18.1 ; U6.2 15.88,65.28 v1(15.88,64.06) ; v1(87.12,34.21) 87.1,34.19 C92.2 ; v1(36.01,41.14) v1(37.12,41.14) v1(38.45,41.14) C6.1 v1(40.96,41.14) 41.08,41.14 v1(41.78,40.44) 41.91,40.31 42.54,40.31 42.8,40.56 42.8,40.82 43.05,41.07 C103.1 ; v1(36.01,41.14) v1(35.31,40.44) v1(35.31,39.49) v1(35.31,38.38) v1(35.31,37.01) v1(35.31,35.63) v1(35.31,34.47) v1(35.94,33.83) v1(37.01,33.83) v1(38.18,33.83) 39.56,33.83 C7.1 v1(40.89,33.89) v1(41.62,34.63) v1(42.28,35.28) v1(43.07,36.07) v1(43.72,36.72) v1(44.45,37.45) ; U27.2 20.21,88.97 v1(20.19,88.95) ; U6.5 15.88,67.18 v1(15.88,68.38) ; v1(63.19,43.6) 63.14,43.6 62.21,44.53 61.85,44.53 61.62,44.77 57.55,44.77 ; U8.2 42.41,23.05 v1(42.8,22.66) ; v1(20.62,8.03) 20.59,8 U17.1 ; v1(38.35,29.64) 38.48,29.77 v1(41.66,29.77) ; v1(59.56,35.1) 59.06,35.61 C1.1 ; U7.2 v1(73.15,41.58) ; v1(78.74,25.96) 78.68,25.89 C89.1 ; 22,75.66 v1(20.95,75.66) ; v1(47.81,36.94) C5.1 v1(46.74,35.61) v1(45.4,35.61) v1(44.2,35.61) v1(43.43,34.85) v1(43.43,33.71) 42.93,33.2 v1(42.04,33.2) 41.66,32.82 v1(41.66,32.17) v1(41.66,31.15) v1(41.66,29.77) ; v1(21.97,28.25) 22.01,28.28 U29.2 ; U20.7 79.42,43.1 79.24,43.28 78.98,43.28 77.98,42.28 v1(77.98,41.83) 77.65,42.16 C29.2 ; R6.1 81.63,4.55 v1(81.64,4.56) ; v1(72.77,56.19) 72.72,56.13 U30.2 ; C96.2 v1(76.45,79.81) ; C10.1 v1(8.76,49.26) ; C91.2 v1(87.28,44.25) ; U25.4 v1(35.18,63.31) ; U7.5 73.15,36.37 ; U28.2 v1(67.94,24.31) ; R9.2 v1(77.84,1.31) ; C17.1 v1(6.98,49.26) ; U23.28 v1(48.77,71.55)
  vias: v1(10.54,68.5) v1(10.54,67.61) v1(10.53,64.63) v1(10.53,63.74) v1(10.84,11.51) v1(11.32,68.5) v1(11.33,67.61) v1(11.3,64.63) v1(11.32,63.74) v1(12.83,9.83) v1(13.86,78.78) v1(15.11,87.94) v1(15.11,87.17) v1(15.24,74.09) v1(15.26,74.85) v1(15.85,87.94) v1(15.85,87.17) v1(16,92.13) v1(16,91.36) v1(16,74.85) v1(16.01,74.09) v1(16.37,63.36) v1(16.37,62.47) v1(16.76,92.13) v1(16.76,91.36) v1(17.14,63.36) v1(17.16,62.47) v1(17.91,31.29) v1(17.91,30.53) v1(18.16,28.88) v1(18.16,28.12) v1(18.67,31.29) v1(18.67,30.53) v1(18.92,28.88) v1(18.92,28.12) v1(23.72,12.46) v1(23.72,11.57) v1(24.61,12.46) v1(24.61,11.57) v1(25.76,14.75) v1(25.76,13.86) v1(26.64,14.75) v1(26.64,13.86) v1(27.12,72.52) v1(27.11,71.76) v1(27.69,87.18) v1(27.69,86.42) v1(27.87,72.52) v1(27.87,71.76) v1(28.22,28.36) v1(28.19,27.48) v1(28.45,87.18) v1(28.44,86.42) v1(28.55,8.4) v1(28.55,7.51) v1(28.7,39.17) v1(28.7,38.41) v1(29.01,28.37) v1(29.01,27.48) v1(29.27,76.38) v1(29.44,8.4) v1(29.44,7.51) v1(29.46,39.17) v1(29.47,38.41) v1(30.35,86.92) v1(30.35,86.16) v1(30.96,8.4) v1(30.96,7.51) v1(31.12,86.92) v1(31.11,86.16) v1(31.85,8.4) v1(31.85,7.51) v1(32.13,25.07) v1(32.13,24.31) v1(32.89,25.07) v1(32.89,24.31) v1(33.63,88.71) v1(33.66,89.71) v1(33.66,86.54) v1(33.66,85.65) v1(33.66,84.76) v1(35.37,53.14) v1(37.72,20.24) v1(37.76,21.2) v1(38.1,48.95) v1(38.1,48.18) v1(38.16,82.79) v1(38.16,81.9) v1(38.57,21.2) v1(38.61,20.24) v1(38.84,48.95) v1(38.85,48.18) v1(39.05,82.79) v1(39.05,81.9) v1(39.12,12.5) v1(39.12,11.61) v1(39.82,69.12) v1(39.95,12.5) v1(39.99,11.61) v1(42.04,61.94) v1(42.8,21.77) v1(42.8,20.95) v1(43.24,84.7) v1(43.24,83.81) v1(43.31,17.83) v1(43.56,22.66) v1(43.56,21.78) v1(43.56,20.88) v1(43.81,61.94) v1(44.13,84.7) v1(44.13,83.81) v1(51.18,22.44) v1(52.01,72.76) v1(52.01,71.87) v1(52.9,72.76) v1(52.9,71.87) v1(54.04,72.76) v1(54.04,71.87) v1(54.93,72.76) v1(54.93,71.87) v1(56.58,67.3) v1(56.58,66.41) v1(57.47,67.3) v1(57.47,66.41) v1(58.99,69.71) v1(58.99,68.82) v1(59.19,62.15) v1(59.19,61.39) v1(59.88,69.71) v1(59.88,68.82) v1(59.94,62.15) v1(59.94,61.39) v1(63.25,57.96) v1(63.25,57.2) v1(63.23,56.19) v1(63.23,55.42) v1(64,57.96) v1(64,57.2) v1(63.98,56.19) v1(63.98,55.42) v1(68.71,73.07) v1(68.96,18.97) v1(68.96,18.21) v1(69.72,18.97) v1(69.72,18.21) v1(69.91,49.94) v1(70.74,31.8) v1(70.74,30.91) v1(70.9,69.01) v1(71.61,31.8) v1(71.61,30.91) v1(72.97,49.91) v1(73.15,36.37) v1(73.41,48.69) v1(74.14,48.69) v1(74.69,65.32) v1(74.67,64.57) v1(74.98,15.54) v1(74.98,14.66) v1(74.98,8.69) v1(75.44,65.33) v1(75.44,64.57) v1(75.87,15.54) v1(75.87,14.66) v1(75.87,8.69) v1(76.62,35.94) v1(77.02,22.66) v1(77.01,13.51) v1(77.01,12.62) v1(77.01,8.81) v1(77.9,13.51) v1(77.9,12.62) v1(77.9,8.81) v1(80.3,29.26) v1(80.38,22.15) v1(80.69,21.01) v1(80.69,20.12) v1(80.69,18.59) v1(80.69,17.7) v1(81.3,29.26) v1(81.41,22.15) v1(81.53,82.47) v1(81.53,81.58) v1(81.58,21.01) v1(81.58,20.12) v1(81.58,18.59) v1(81.58,17.7) v1(82.33,29.26) v1(82.38,82.47) v1(82.42,81.58) v1(82.41,22.15) v1(83.31,82.47) v1(83.31,81.55) v1(83.33,29.26) v1(84.33,29.26) v1(85.33,29.26) v1(86.33,29.26) v1(87.32,29.2) v1(87.74,20.94) v1(87.74,20.05) v1(87.74,18.59) v1(87.74,17.7) v1(88.32,29.2) v1(88.39,28.2) v1(88.39,27.2) v1(88.39,26.2) v1(88.39,25.2) v1(88.39,24.16) v1(88.39,23.16) v1(88.4,22.15) v1(88.63,20.94) v1(88.63,20.05) v1(88.63,18.59) v1(88.63,17.7) v2(5,95) v2(5,5) v2(95,95) v2(95,5)
VDDA: length 34.5
  Top Layer w0.254: C8.1 62.29,59.72 R2.2 62.36,59.66 v1(62.36,58.72) ; U1.22 54.5,41.53 55.47,40.56 56.2,40.56 56.45,40.31 56.45,40 R3.2 56.38,38.33 C104.2 v1(57.21,38.28)
  PWR w0.254: v1(62.36,58.72) 62.36,48.55 61.59,47.79 61.59,38.79 61.09,38.28 v1(57.21,38.28)
BLDC1_24V: length 29.2
  Top Layer w0.508: 12.25,91.75 12.25,91.75 C110.1 ; 12.25,91.75 12.25,92.89 ; 12.25,91.75 C128.2 12.25,87.36 12.06,87.17 NOREF#24.1 ; R51.2 18.42,92.51 18.03,92.89 12.25,92.89 12.25,92.89 ; 12.25,92.89 12.25,93.96 12.69,94.4 D1.2
  PWR w0.508: CN2.2 9.02,81.08 9.53,81.58 9.53,86.67 10.03,87.17 NOREF#24.1
BLDC1_BRA: length 28.3
  Top Layer w0.254: U19.13 22.2,70.52 v1(22.14,70.57)
  Bottom Layer w0.254: CN2.6 7.62,60.76 8.13,61.27 8.13,69.27 8.51,69.65 18.42,69.65 18.92,70.16 18.92,71.17 19.18,71.42 21.84,71.42 22.14,71.13 v1(22.14,70.57)
BLDC1_BRA_3V3: length 33.5
  Top Layer w0.254: U1.60 51.5,59.28 v1(50.95,59.83) ; U19.2 22.2,62.1 v1(22.28,62.03)
  Bottom Layer w0.254: v1(50.95,59.83) 49.52,61.27 25.78,61.27 24.99,62.05 22.3,62.05 v1(22.28,62.03)
BLDC1_FG: length 18.8
  Top Layer w0.254: U6.4 16.52,71.04 16.26,71.3 10.16,71.3 9.27,72.19 9.27,75.49 8.76,76 CN2.3
BLDC1_FG_3V3: length 41.1
  Top Layer w0.254: v1(51.85,59.83) 52,59.67 U1.59 ; v1(19.56,64.95) 18.03,64.95 17.14,64.06 16.78,64.06 16.53,64.31 16.53,65.27 U6.3
  Bottom Layer w0.254: v1(51.85,59.83) 50.89,60.78 50.66,60.78 49.82,61.62 46.49,61.62 43.04,65.08 19.69,65.08 v1(19.56,64.95)
BLDC1_PWM: length 20.5
  Top Layer w0.254: U19.10 24.15,70.64 23.62,71.17 18.16,71.17 17.65,70.66 v1(17.27,70.66)
  Bottom Layer w0.254: v1(17.27,70.66) 5.84,70.66 CN2.4
BLDC1_PWM_3V3: length 31
  Top Layer w0.254: U1.62 50.5,58.63 48.83,60.3 v1(48.43,60.3) ; U19.5 24.13,63.61 v1(24.13,61.47)
  Bottom Layer w0.254: v1(48.43,60.3) 24.46,60.3 24.13,60.63 v1(24.13,61.47)
BLDC1_REV: length 24.9
  Top Layer w0.254: v1(22.9,70.59) 22.9,69.28 U19.12
  Bottom Layer w0.254: CN2.5 7.37,65.84 7.75,66.22 7.75,69.52 8.25,70.03 18.29,70.03 18.54,70.28 18.54,71.55 18.8,71.81 22.61,71.81 22.9,71.51 v1(22.9,70.59)
BLDC1_REV_3V3: length 32.6
  Top Layer w0.254: v1(25.02,60.88) 23.24,60.88 22.86,61.27 22.86,63.62 U19.3 ; v1(49.57,60.39) 51,58.96 U1.61
  Bottom Layer w0.254: v1(49.57,60.39) 49.07,60.88 v1(25.02,60.88)
BLDC2_24V: length 57.3
  Top Layer w0.508: R53.2 64.39,23.05 64.06,22.73 64.06,18.63 64.04,18.61 ; NOREF#20.1 66.55,13.64 66.1,14.09 C130.2 66.11,16.32 C114.1 64.04,18.61 ; 64.04,18.61 62.4,18.61 D2.2
  Bottom Layer w0.508: CN3.2 94.44,19.23 92.07,19.23 91.44,18.59 91.44,9.45 89.97,7.98 69.04,7.98 67.69,9.32 NOREF#20.1
BLDC2_BRA: length 19.6
  Top Layer w0.254: U20.13 82.68,36.42 82.68,34.59 83.88,33.39 90.11,33.39 90.68,33.96 90.68,38.91 91.31,39.55 94.44,39.55 CN3.6
BLDC2_BRA_3V3: length 34.9
  Top Layer w0.254: U20.2 82.67,44.13 v1(82.17,44.63) ; v1(62.36,47.73) 62.32,47.77 57.55,47.77
  Bottom Layer w0.254: v1(62.36,47.73) 62.87,48.23 62.87,50.34 63.3,50.78 80.21,50.78 81.53,49.45 81.53,45.26 v1(82.17,44.63)
BLDC2_FG: length 34
  Top Layer w0.254: CN3.3 94.44,24.31 90.68,24.31 90.04,24.94 90.04,29.39 89.28,30.15 78.36,30.15 77.85,30.66 77.85,34.72 77.34,35.23 77.05,35.23 77.03,35.21 74.6,35.21 74.59,35.23 73.28,35.23 72.5,36.01 U7.4
BLDC2_FG_3V3: length 21
  Top Layer w0.254: U7.3 72.5,42.36 72.14,42.72 65.15,42.72 64.77,43.1 64.77,46.41 64.39,46.79 57.57,46.79 57.55,46.77
BLDC2_PWM: length 18.9
  Top Layer w0.254: U20.10 80.72,34.78 83.19,32.31 90.42,32.31 90.93,31.8 90.93,29.77 91.37,29.34 94.38,29.34 CN3.4
BLDC2_PWM_3V3: length 29.5
  Top Layer w0.254: v1(80.67,43.13) 80.67,42.08 U20.5 ; v1(68.58,49.33) 68.52,49.27 U1.36
  Bottom Layer w0.254: v1(80.67,43.13) 80.67,43.72 80.52,43.87 76.45,43.87 76.07,44.25 76.07,48.18 74.93,49.33 v1(68.58,49.33)
BLDC2_REV: length 16
  Top Layer w0.254: CN3.5 94.44,34.47 92.46,34.47 92,34.01 92,33.38 91.57,32.94 83.69,32.94 82.02,34.62 U20.12
BLDC2_REV_3V3: length 31.3
  Top Layer w0.254: U1.34 57.59,48.31 v1(64.26,48.31) ; v1(77.72,42.98) 78.46,43.71 81.69,43.71 82.02,43.38 U20.3
  Bottom Layer w0.254: v1(64.26,48.31) 64.52,48.56 68.33,48.56 68.83,48.06 68.83,43.61 69.09,43.36 72.14,43.36 72.52,42.98 v1(77.72,42.98)
BLDC3_24V: length 29.4
  Top Layer w0.508: 15.11,32.56 15.11,31.1 C118.1 15.17,30.78 13.97,30.78 13.52,30.34 C132.2 12.06,28.5 NOREF#25.1 ; 15.11,32.56 15.11,32.56 20.19,32.56 20.7,32.06 R55.2 ; 15.11,32.56 15.11,33.71 15.37,33.96 16.63,33.96 D3.2
  PWR w0.508: NOREF#25.1 9.91,27.61 9.4,28.12 9.4,33.33 8.76,33.96 CN4.2
BLDC3_BRA: length 36.2
  Top Layer w0.254: U21.13 33.69,14.49 32.77,15.42 32.77,17.07 32.38,17.45 8.51,17.45 7.87,16.81 7.87,14.02 7.49,13.64 CN4.6
BLDC3_BRA_3V3: length 81.6
  Top Layer w0.254: U21.2 v1(50.59,14.49) ; v1(59.06,38.91) 58.17,38.91 57.78,39.29 57.78,41.2 57.4,41.58 56.26,41.58 56,41.84 U1.25
  Bottom Layer w0.254: v1(50.59,14.49) 51.14,14.49 51.44,14.78 51.44,17.45 51.94,17.96 57.53,17.96 58.04,18.47 58.04,23.55 60.12,25.63 76.38,25.63 77.64,26.89 77.64,37.85 76.58,38.91 v1(59.06,38.91)
BLDC3_FG: length 37.9
  Top Layer w0.254: CN4.3 8,28.88 8.51,28.37 8.51,23.67 9.14,23.04 33.15,23.04 33.81,23.7 U8.4
BLDC3_FG_3V3: length 77.4
  Top Layer w0.254: v1(56.64,41) 56.59,40.94 55.75,40.94 55.5,41.2 U1.24 ; v1(41.4,23.67) 39.91,23.67 U8.3
  Bottom Layer w0.254: v1(56.64,41) 58.12,41 58.29,40.82 58.29,37.14 58.67,36.75 67.69,36.75 68.2,37.26 68.2,38.02 68.45,38.28 75.95,38.28 77.29,36.94 77.29,27.55 75.82,26.09 58.93,26.09 56.51,23.67 v1(41.4,23.67)
BLDC3_PWM: length 36
  Top Layer w0.254: U21.10 34.92,16.44 34.29,17.07 34.29,17.96 33.73,18.52 23.82,18.52 22.61,19.74 8.64,19.74 8,20.37 8,23.16 7.49,23.67 5.72,23.67 CN4.4
BLDC3_PWM_3V3: length 80.3
  Top Layer w0.254: U1.26 61.57,44.27 63.63,42.22 63.63,41.45 64.52,40.56 v1(71.89,40.56) ; U21.5 v1(53.47,16.44)
  Bottom Layer w0.254: v1(71.89,40.56) 72.01,40.69 76.71,40.69 78.61,38.79 78.61,26.73 76.8,24.91 61.19,24.91 59.18,22.91 59.18,17.07 58.68,16.57 53.59,16.57 v1(53.47,16.44)
BLDC3_REV: length 33.3
  Top Layer w0.254: U21.12 33.81,15.14 33.27,15.67 33.27,17.45 32.77,17.96 23.37,17.96 22.61,18.72 CN4.5
BLDC3_REV_3V3: length 83.1
  Top Layer w0.254: 57.55,45.77 60.07,45.77 60.2,45.9 61.01,45.9 v1(61.01,45.89) ; v1(52.07,15.29) 51.92,15.14 U21.3
  Bottom Layer w0.254: v1(61.01,45.89) 67.7,45.89 68.33,45.26 68.33,40.56 69.47,39.42 77.47,39.42 78.1,38.79 78.1,26.72 76.65,25.27 60.91,25.27 58.55,22.91 58.55,17.83 58.23,17.51 52.9,17.51 52.71,17.32 52.71,15.93 v1(52.07,15.29)
BLDC4_24V: length 49.9
  Top Layer w0.508: 76.81,61.55 76.84,61.52 76.84,58.34 76.42,57.93 R57.2 ; 76.81,61.55 78.59,61.55 D4.2 ; 76.81,61.55 C122.1 72.68,61.55 C135.2 70.59,61.54 70.1,62.03 NOREF#21.1 ; NOREF#6.1 80.26,66.98 81.03,66.22 81.03,64.19 81.66,63.55 86.15,63.55 86.17,63.57 88.08,63.57 88.1,63.55 90.04,63.55 90.93,64.44 90.93,66.98 91.82,67.87 CN5.2
  PWR w0.508: NOREF#21.1 NOREF#6.1
BLDC4_BRA: length 26.5
  Top Layer w0.254: U22.13 79.15,77.55 79.25,77.65 v1(80.01,77.65)
  Bottom Layer w0.254: v1(80.01,77.65) 90.68,77.65 91.19,78.16 91.19,87.68 91.69,88.19 CN5.6
BLDC4_BRA_3V3: length 42.8
  Top Layer w0.254: U22.2 v1(70.41,77.55) ; U1.42 57.57,52.25 67.18,52.25 67.94,53.01 v1(67.94,54.53)
  Bottom Layer w0.254: v1(70.41,77.55) 68.33,77.55 67.93,77.16 67.93,75.98 65.41,73.46 65.41,54.92 65.79,54.53 v1(67.94,54.53)
BLDC4_FG: length 21.1
  Top Layer w0.254: v1(77.72,69.14) 77.71,69.12 U9.4
  Bottom Layer w0.254: v1(77.72,69.14) 91.82,69.14 92.33,69.65 92.33,72.44 92.84,72.95 CN5.3
BLDC4_FG_3V3: length 34.4
  Top Layer w0.254: U9.3 73.55,69.12 v1(73.53,69.14) ; v1(66.93,51.36) 66.84,51.27 U1.40
  Bottom Layer w0.254: v1(66.93,51.36) 70.74,51.36 71.25,51.87 71.25,68.5 71.88,69.14 v1(73.53,69.14)
BLDC4_PWM: length 18.2
  Top Layer w0.254: U22.10 79.36,75.6 v1(79.38,75.62)
  Bottom Layer w0.254: 94.49,78.03 92.84,78.03 92.58,77.78 92.58,77.14 92,76.56 80.39,76.56 80.14,76.3 80.14,75.74 80.01,75.62 v1(79.38,75.62)
BLDC4_PWM_3V3: length 35.9
  Top Layer w0.254: v1(59.02,53.77) U1.45 ; U22.5 v1(71.04,75.6)
  Bottom Layer w0.254: v1(71.04,75.6) 69.58,75.6 69.34,75.36 69.34,70.79 68.83,70.28 68.83,54.41 68.2,53.77 59.02,53.77 v1(59.02,53.77)
BLDC4_REV: length 22.1
  Top Layer w0.254: 77.98,76.9 v1(79.35,76.9)
  Bottom Layer w0.254: v1(79.35,76.9) 80.23,76.9 80.24,76.91 91.09,76.91 91.69,77.52 91.69,82.6 92.2,83.11 94.49,83.11
BLDC4_REV_3V3: length 37.6
  Top Layer w0.254: U1.43 57.56,52.76 66.93,52.76 67.36,53.19 v1(67.36,56.41) ; 72.38,76.9 72.37,76.92 v1(71.04,76.92)
  Bottom Layer w0.254: v1(71.04,76.92) 69.63,76.92 68,75.29 68,71.5 68.17,71.32 68.17,70.26 67.36,69.45 v1(67.36,56.41)
BOOT0: length 43.7
  Top Layer w0.254: v1(33.02,47.68) 29.34,47.68 28.83,48.18 28.83,53.77 27.94,54.66 H1.1 ; v1(35.58,47.53) 36.8,47.53 R1.2 36.84,47.55 39.24,47.55 39.53,47.27 U1.94
  Bottom Layer w0.254: v1(35.58,47.53) 35.43,47.68 v1(33.02,47.68)
MC7RE_SBUS: length 71
  Top Layer w0.254: R45.2 35.57,48.52 34.52,47.47 34.52,47.4 33.8,46.69 33.73,46.69 v1(33.19,46.14)
  Bottom Layer w0.254: v1(33.19,46.14) 25.15,38.1 25.15,17.58 26.03,16.69 33.91,16.69 34.8,15.8 34.8,8.81 35.56,8.05 48.39,8.05 49.15,7.29 P1.3
ORI_24V: length 149.7
  Top Layer w0.508: C129.2 28.52,91.56 28.07,91.11 C108.2 28,89.59 26.8,89.59 26.18,88.97 25.16,88.97 ; C129.2 31.95,91.56 NOREF#12.1 ; C129.2 30.48,93.9 29.84,94.54 L9.2 ; NOREF#8.1 71.85,43.87 71.41,44.31 C134.2 73.82,46.05 C120.2 75.71,46.05 ; 67.94,29.63 67.94,31.23 C112.2 67.88,33.85 C131.2 67.75,33.96 65.79,33.96 64.77,34.98 NOREF#13.1 ; 67.94,29.63 U28.5 ; 67.94,29.63 66.43,29.63 65.91,30.15 65.91,31.8 65.47,32.25 62.34,32.25 62.24,32.15 ; 67.94,29.63 68.59,29.63 68.9,29.33 68.9,28 ; R8.1 73.98,8.11 73.28,8.81 NOREF#22.1 75.3,9.96 C37.2 77.36,10.08 C36.2 78.79,10 79.05,9.75 U10.3 ; U27.4 24.85,88.02 25.16,88.33 25.16,88.97 ; 25.16,88.97 U27.5 ; 29.74,78.39 27,75.66 U31.5 ; 29.74,78.39 30.67,77.46 C124.2 30.68,76.37 C137.2 ; 29.74,78.39 29.29,78.84 L13.2 33.78,81.2 NOREF#10.1 ; 75.71,46.05 75.69,46.07 75.69,50.09 75.18,50.6 73.15,50.6 72.72,51.03 72.72,51.64 ; 75.71,46.05 78.39,46.05 78.65,46.31 L12.2 ; U16.3 63.82,70.57 62.45,70.57 62.04,70.16 C77.2 62.04,66.86 C78.2 NOREF#9.1 62.08,64.82 66.42,64.82 66.68,65.08 R32.1 ; C116.2 30,31.19 30.69,31.88 L11.2 ; C116.2 32.41,29.6 C133.2 32.44,29.64 34.54,29.64 35.18,29.01 NOREF#15.1 ; C116.2 29.91,29.51 27.81,29.51 27.56,29.26 27.56,28.63 27.22,28.28 26.71,28.28 ; U31.4 25.51,74.71 25.78,74.98 25.78,75.65 ; U30.4 71.77,51.86 72.01,51.61 72.69,51.61 72.72,51.64 ; U17.3 20.77,9.9 21.21,10.34 21.21,12.12 C83.2 21.18,14.3 C84.2 21.18,16.34 NOREF#18.1 20.97,16.54 16.15,16.54 15.79,16.18 R35.1 ; 72.72,51.64 U30.5 ; U29.4 26.39,27.33 26.71,27.65 26.71,28.28 ; U29.5 26.71,28.28
  PWR w0.254: v1(49.4,22.44) 49.4,25.07
  vias: v1(82.17,75.23) v1(82.2,73.71) v1(82.2,72.19) v1(82.2,70.66) v1(82.71,74.47) v1(82.71,72.95) v1(82.71,71.42) v1(82.71,69.9) v1(83.17,75.23) v1(83.2,73.71) v1(83.2,72.19) v1(83.2,70.66) v1(83.71,74.47) v1(83.71,72.95) v1(83.71,71.42) v1(83.71,69.9) v1(84.17,75.23) v1(84.2,73.71) v1(84.2,72.19) v1(84.2,70.66) v1(84.71,74.47) v1(84.71,72.95) v1(84.71,71.42) v1(84.71,69.9) v1(85.17,75.23) v1(85.2,73.71) v1(85.2,72.19) v1(85.2,70.66) v1(85.71,74.47) v1(85.71,72.95) v1(85.71,71.42) v1(85.71,69.9) v1(86.17,75.23) v1(86.2,73.71) v1(86.2,72.19) v1(86.2,70.66) v1(86.71,74.47) v1(86.71,72.95) v1(86.71,71.42) v1(86.71,69.9) v1(86.72,56.03) v1(86.72,55.31) v1(87.52,56.03) v1(87.52,55.31) v1(88.26,67.88)
ORI_24V_IN:
  vias: v1(86.74,53.09) v1(86.7,52.37) v1(87.54,53.09) v1(87.5,52.37)
PUMP_12V: length 54.1
  Top Layer w0.254: R7.2 84.81,1.82 C40.2
  Top Layer w0.508: NOREF#5.1 86.36,20.63 C38.2 C39.2 86.3,18.14 L1.1 86.3,6.34 84.84,4.88 84.84,3.44 R7.2 ; 73.66,19.1 72.77,19.1 72.01,19.86 72.01,24.05 72.89,24.94 U18.5
  PWR w0.508: NOREF#5.1 86.36,26.59 85.98,26.97 C88.1 80.52,26.97 80.01,26.47 v4(80.01,24.82) 80.01,23.29 79.63,22.91 79.63,19.48 79.25,19.1 NOREF#16.1
PUMP_IN1: length 81.5
  Top Layer w0.254: U1.96 42.44,46.28 39.5,46.28 39.36,46.14 38.87,46.14 38.73,46.28 34.8,46.28 33.66,45.14 33.66,34.72 35.69,32.69 35.69,26.72 36.07,26.34 v1(56.01,26.34) ; v1(74.17,32.94) 74.17,31.55 U18.3
  Bottom Layer w0.254: v1(74.17,32.94) 74.17,36.63 73.66,37.14 69.6,37.14 69.22,36.75 69.22,29.13 66.7,26.62 56.29,26.62 v1(56.01,26.34)
PUMP_IN2: length 85.9
  Top Layer w0.254: v1(39.12,46.72) 39.16,46.77 42.45,46.77 ; U18.2 75.44,31.55 v1(75.44,32.94)
  Bottom Layer w0.254: v1(39.12,46.72) 34.61,46.72 32.06,44.18 32.06,32.38 33.4,31.04 33.4,27.23 33.66,26.97 66.55,26.97 68.83,29.26 68.83,37.14 69.22,37.52 75.18,37.52 75.44,37.26 v1(75.44,32.94)
PUMP_OUT1: length 42.1
  Top Layer w0.508: C90.1 74.36,19.8 74.8,19.35 74.8,17.45 74.49,17.13 72.33,17.13 71.37,16.18 71.37,11.61 70.68,10.91 57.98,10.91 57.4,10.34 57.4,7.76 DC1.1 DC1.1 ; U18.6 74.16,24.86 72.77,23.47 72.77,21.9 73.28,21.39 74.04,21.39 74.36,21.07 74.36,20.37
PUMP_OUT2: length 33.4
  Top Layer w0.508: U18.8 76.71,26 76.71,24.44 76.96,24.18 77.85,24.18 78.1,23.93 78.1,21.69 77.82,21.4 77.74,21.4 77.72,21.39 76.2,21.39 75.76,20.94 C90.2 75.76,16.65 75.44,16.33 73.05,16.33 72.26,15.54 72.26,2.34 71.63,1.7 DC1.2
PUMP_VREF: length 76.6
  Top Layer w0.254: v1(68.2,35.86) 71.75,35.86 72.9,34.72 72.9,31.55 U18.4 ; 42.45,45.77 35.3,45.77 v1(35.18,45.64)
  Bottom Layer w0.254: v1(68.2,35.86) 67.31,35.86 66.93,35.48 66.93,28.75 65.55,27.38 35.03,27.38 33.91,28.5 33.91,31.29 32.64,32.56 32.64,43.1 v1(35.18,45.64)
REMOTE_DATA: length 5
  Top Layer w0.254: R44.1 40.39,53.14 40.64,52.88 40.64,50.74 Q1.3 42.41,50.72 U1.87
SPI3_CS: length 13.4
  Top Layer w0.254: U25.1 v1(38.99,63) ; U1.77 42.2,55.77 42.16,55.73 41.33,55.73 40.72,56.35 v1(40.72,62.03)
  Bottom Layer w0.254: v1(40.72,62.03) 40.7,62.04 40.7,63.74 40.26,64.19 39.24,64.19 38.99,63.93 v1(38.99,63)
SPI3_MISO: length 14.6
  Top Layer w0.254: U1.79 42.38,54.7 40.48,54.7 40.13,55.04 40.13,63.17 39.71,63.59 38.26,63.59 37.72,63.04 U25.2
SPI3_MOSI: length 9.3
  Top Layer w0.254: U25.5 35.18,54.66 35.56,54.28 42.44,54.28 U1.80
SPI3_SCK: length 7.1
  Top Layer w0.254: U1.78 40.97,55.27 v1(40.96,55.28) ; U25.6 36.45,55.55 36.7,55.3 v1(37.08,55.3)
  Bottom Layer w0.254: v1(40.96,55.28) 40.94,55.3 v1(37.08,55.3)
STEPPER_24V: length 108.9
  Top Layer w0.508: U23.4 46.82,84.19 46.74,84.27 46.74,84.88 46.23,85.39 45.59,85.39 45.34,85.65 C99.1 ; C99.1 42.43,86.55 41.66,85.78 C101.2 41.66,82.36 41.66,80.95 42.27,80.34 U23.11 ; C99.1 45.34,87.59 ; R59.2 19.05,78.16 18.67,78.54 16.13,78.54 15.62,79.05 15.62,81.18 D5.2 12.94,81.19 12.41,80.66 C126.1 12.41,76.36 C136.2 12.32,76.27 NOREF#4.1 ; 45.34,87.59 45.34,88.53 R43.1 45.29,89.39 44.32,90.35 NOREF#3.1 ; 45.34,87.59 45.32,87.57 C102.1
  PWR w0.508: NOREF#4.1 12.32,72.95 12.7,72.57 21.34,72.57 21.97,73.2 21.97,96.7 22.86,97.59 43.69,97.59 44.32,96.95 NOREF#3.1
STEPPER_AOUT1: length 31.4
  Top Layer w0.508: U23.5 46.17,79.94 v4(46.11,80)
  Bottom Layer w0.254: v4(46.11,80) 46.11,81.46 46.41,81.76 48.56,81.76 49.63,82.83 49.63,84.99 49.66,85.01 49.66,90.73 50.29,91.36 53.34,91.36 54.61,92.63 63.37,92.63 63.63,92.89 CN6.1
STEPPER_AOUT2: length 27.5
  Top Layer w0.508: U23.7 44.87,80.33 44.93,80.39 44.93,80.4 v4(44.93,80.4)
  Bottom Layer w0.254: v4(44.93,80.4) 44.96,80.43 44.96,81.86 45.21,82.12 48.41,82.12 49.28,82.98 49.28,90.98 50.04,91.75 53.21,91.75 54.48,93.02 58.17,93.02 58.55,93.4 CN6.2
STEPPER_BOUT1: length 21.1
  Top Layer w0.508: U23.10 42.98,78.81 v4(42.98,80)
  Bottom Layer w0.254: v4(42.98,80) 42.98,82.53 43.31,82.86 48.13,82.86 48.51,83.24 48.51,94.54 CN6.4
STEPPER_BOUT2: length 23.8
  Top Layer w0.508: U23.8 v4(44.22,80.81)
  Bottom Layer w0.254: CN6.3 53.47,92.76 52.96,92.25 49.78,92.25 48.9,91.36 48.9,83.11 48.26,82.47 44.45,82.47 44.22,82.24 v4(44.22,80.81)
STEPPER_DECAY: length 20.4
  Top Layer w0.254: U23.19 42.92,71.85 v1(42.91,71.83) ; U1.57 52.96,57.86 52.96,60.76 52.58,61.14 v1(51.56,61.14)
  Bottom Layer w0.254: v1(51.56,61.14) 50.8,61.14 43.03,68.91 43.03,71.71 v1(42.91,71.83)
STEPPER_DIR: length 20.4
  Top Layer w0.254: U23.20 43.61,72.97 v1(43.61,71.55) ; v1(50.38,62.39) 51.05,61.72 52.5,61.72 53.5,60.72 U1.56
  Bottom Layer w0.254: v1(50.38,62.39) 44.33,68.44 44.01,68.44 43.61,68.83 v1(43.61,71.55)
STEPPER_MODE0: length 19.7
  Top Layer w0.254: U1.53 54.99,57.83 54.99,63.04 54.61,63.42 53.09,63.42 46.17,70.34 U23.24
STEPPER_MODE1: length 20
  Top Layer w0.254: U1.52 55.5,63.78 55.25,64.04 53.19,64.04 46.82,70.41 U23.25
STEPPER_MODE2: length 19.9
  Top Layer w0.254: U23.26 47.47,70.69 53.47,64.69 55.5,64.69 56.01,64.19 56.01,57.82 U1.51
STEPPER_NEABL: length 19.9
  Top Layer w0.254: U1.55 53.97,57.84 53.97,62.03 53.59,62.41 52.45,62.41 44.22,70.64 U23.21
STEPPER_NFLT: length 23
  Top Layer w0.254: U23.18 42.29,72.99 42.29,70.41 42.67,70.03 44.2,70.03 46.48,67.74 46.48,65.96 46.23,65.71 R40.1 44.12,65.39 44.12,65.03 46.35,62.79 47.09,62.79 47.35,62.53 47.35,60.02 48.01,59.36 48.76,59.36 49.5,58.62 U1.64
STEPPER_NHOME: length 19.1
  Top Layer w0.254: U1.58 52.45,57.87 52.45,60.3 v1(52.38,60.38) ; v1(52.83,67.23) 52.83,67.87 52.45,68.25 50.68,68.25 49.67,69.27 R39.1 48.51,70.66 48.12,71.06 U23.27
  Bottom Layer w0.254: v1(52.38,60.38) 52.38,60.55 52.83,61.01 v1(52.83,67.23)
STEPPER_NRST: length 19
  Top Layer w0.254: U1.65 49.02,57.84 49.02,58.6 48.64,58.98 47.88,58.98 46.99,59.87 46.99,61.95 v1(46.73,62.2) ; v1(40.89,71.81) 40.97,71.88 U23.16
  Bottom Layer w0.254: v1(40.89,71.81) 40.89,68.05 v1(46.73,62.2)
STEPPER_NSLP: length 19.3
  Top Layer w0.254: U1.63 50,58.63 48.91,59.72 48.16,59.72 47.7,60.17 47.7,62.83 47.16,63.37 v1(46.77,63.37) ; v1(41.66,71.81) 41.66,72.98 U23.17
  Bottom Layer w0.254: v1(46.77,63.37) 41.66,68.49 v1(41.66,71.81)
STEPPER_STEP: length 19.9
  Top Layer w0.254: U23.22 44.87,70.88 52.83,62.92 54.1,62.92 54.48,62.53 54.48,57.83 U1.54
STEPPER_V3P3OUT: length 35.6
  Top Layer w0.254: 42.93,69.02 42.93,69.01 R40.2 ; 42.93,69.02 v1(44.28,69.02) ; 42.93,69.02 41.66,69.01 41.15,69.52 41.15,70.28 40.89,70.54 39.86,70.54 C98.2 39.04,70.49 38.86,70.66 38.86,71.17 38.99,71.3 39.24,71.3 ; 40.97,79.94 41.39,79.94 41.62,79.72 U23.12 ; 40.97,79.94 U23.13 ; 40.97,79.94 40.97,80.24 40.77,80.44 40,80.44 39.24,79.68 39.24,71.3 ; 39.24,71.3 40,71.3 40.26,71.55 40.26,72.96 U23.15
  Bottom Layer w0.254: v1(51.17,70.66) 51.18,70.65 51.18,69.27 50.93,69.01 47.12,69.01 47.11,69.02 v1(44.28,69.02)
SWCLK: length 50.6
  Top Layer w0.254: v1(41.35,56.95) 41.35,56.49 41.57,56.27 U1.76 ; H1.5 v1(20.7,44.5)
  Bottom Layer w0.254: v1(20.7,44.5) 30.86,44.5 31.24,44.88 31.24,56.31 32.83,57.9 39.56,57.9 40,57.45 40.84,57.45 v1(41.35,56.95)
SWDIO: length 62.7
  Top Layer w0.254: U1.72 45.47,57.85 45.47,58.98 44.7,59.74 44.7,62.15 44.2,62.66 41.4,62.66 41.15,62.92 41.15,64.19 40.77,64.57 35.05,64.57 34.16,63.68 34.16,51.6 34.17,51.59 34.17,50.62 34.16,50.61 34.16,47.55 33.66,47.04 H1.4
U10_FB: length 10.3
  Top Layer w0.254: R7.1 83.36,3.36 C40.1 83.3,1.7 79.76,1.7 79.56,1.9 v1(79.56,3.42) ; U10.4 79.07,6.31 v1(79.07,5.41)
  Bottom Layer w0.254: v1(79.07,5.41) 79.07,3.73 79.39,3.42 v1(79.56,3.42)
U16_FB: length 8.6
  Top Layer w0.254: R31.1 69.8,74.74 C81.1 69.85,71.81 69.6,71.55 68.72,71.55 R30.2 68.7,71.55 67.82,71.55 67.44,71.17 67.44,70.79 67.24,70.6 U16.4
U17_FB: length 6.3
  Top Layer w0.254: v1(16.76,9.96) 17.38,9.96 U17.4 ; C87.1 15.2,7.51 R34.1 15.25,9.81 R37.2
  Bottom Layer w0.254: v1(15.28,9.83) 15.41,9.96 v1(16.76,9.96)
USART1_RX: length 45.1
  Top Layer w0.254: U26.2 36.7,94.79 37.08,94.41 38.1,94.41 38.86,93.65 38.86,85.14 37.11,83.38 37.11,69.5 42.27,64.34 43.66,64.34 45.47,62.53 45.47,62.03 46.23,61.27 46.23,59.49 47,58.72 U1.69
USART1_TX: length 43.7
  Top Layer w0.254: U26.1 39.24,85.01 37.47,83.24 37.47,69.65 42.42,64.69 43.81,64.69 45.85,62.66 45.85,62.15 46.61,61.39 46.61,59.61 47.5,58.72 U1.68
